# Altium project TMDX654GPEVM.PrjPcb (part 14 of 24)

## Sheet 32-APPLICATION BOARD CONNECTOR.SchDoc
size 513 x 386 mm
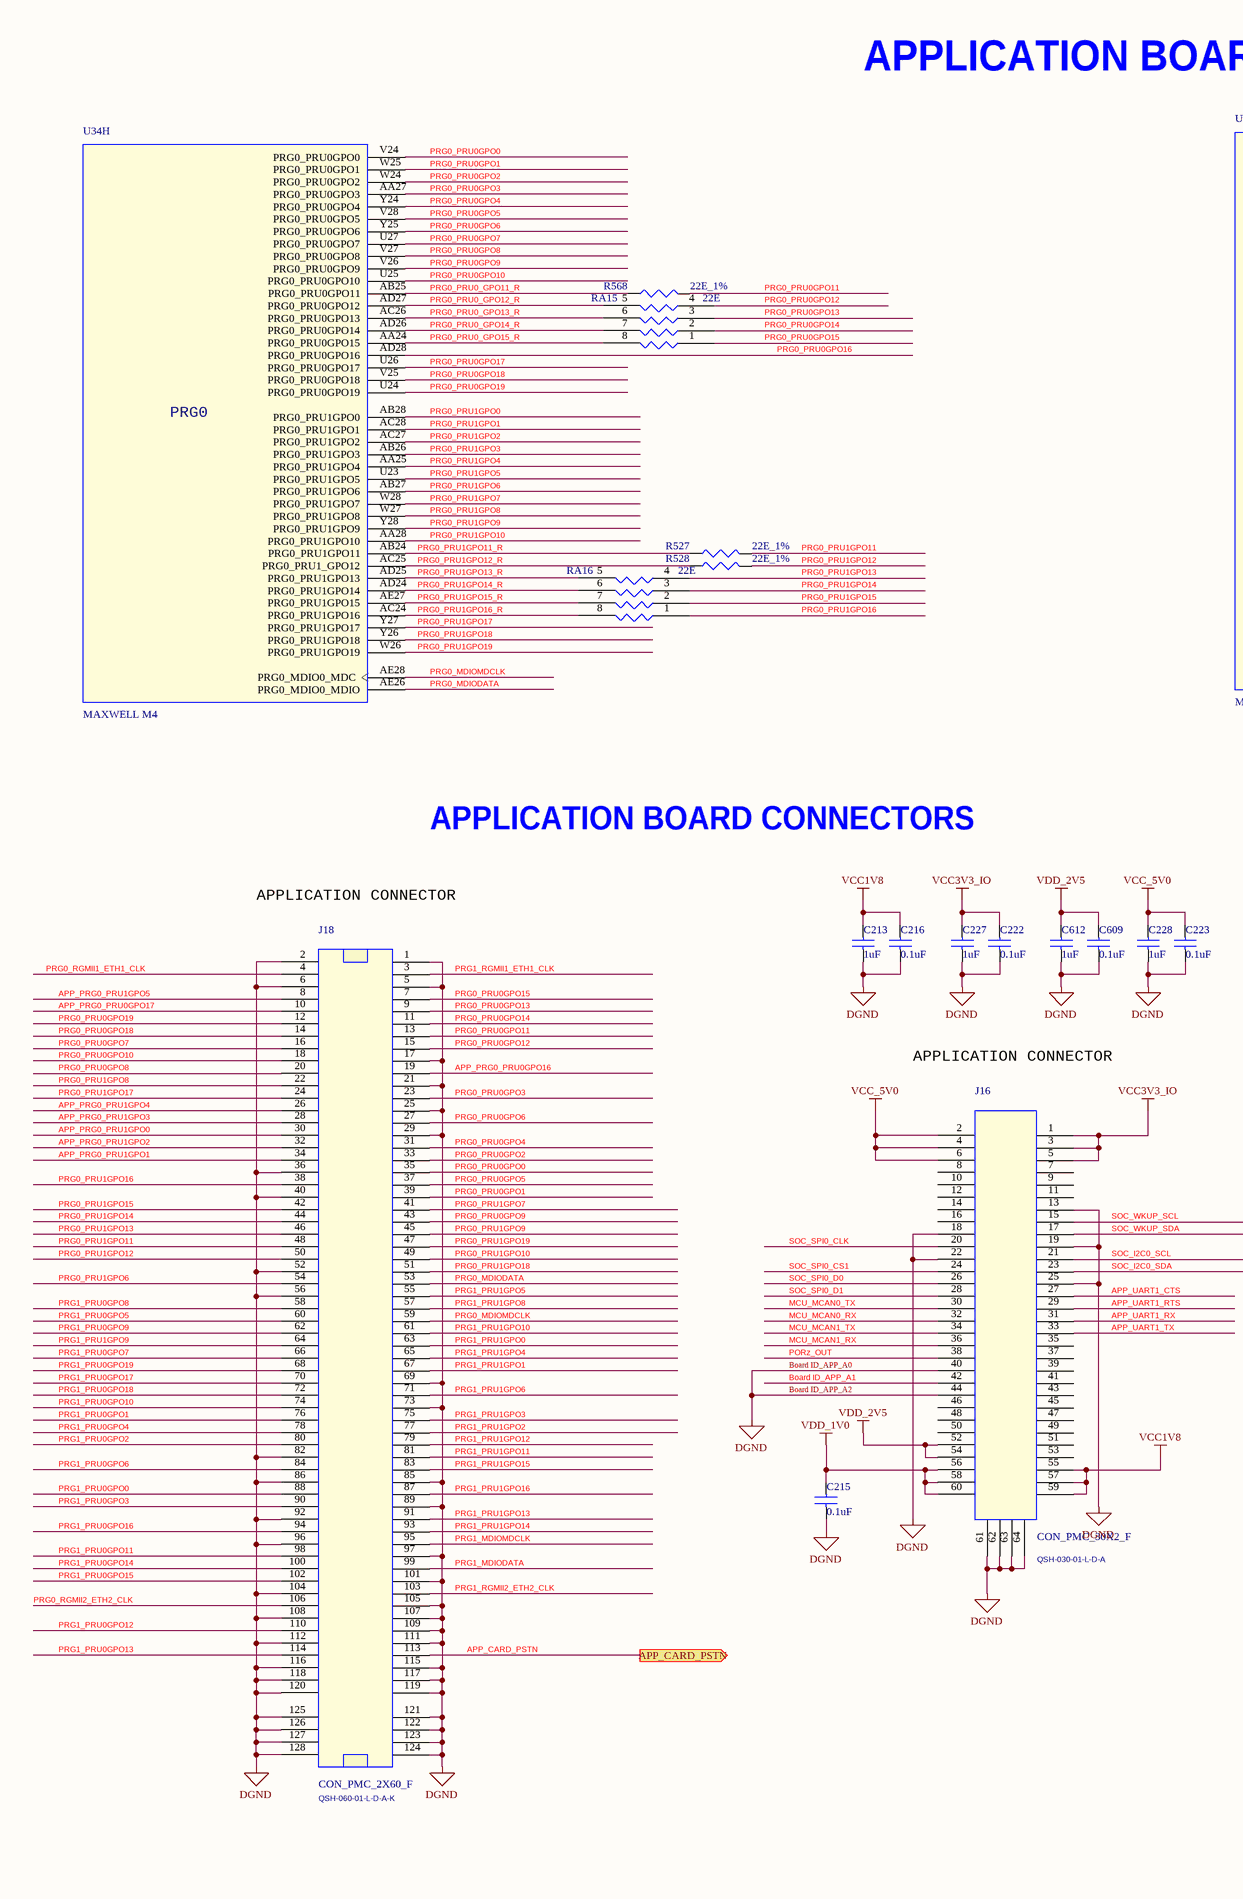
[diagram p58: 32-APPLICATION BOARD CONNECTOR.SchDoc, left]
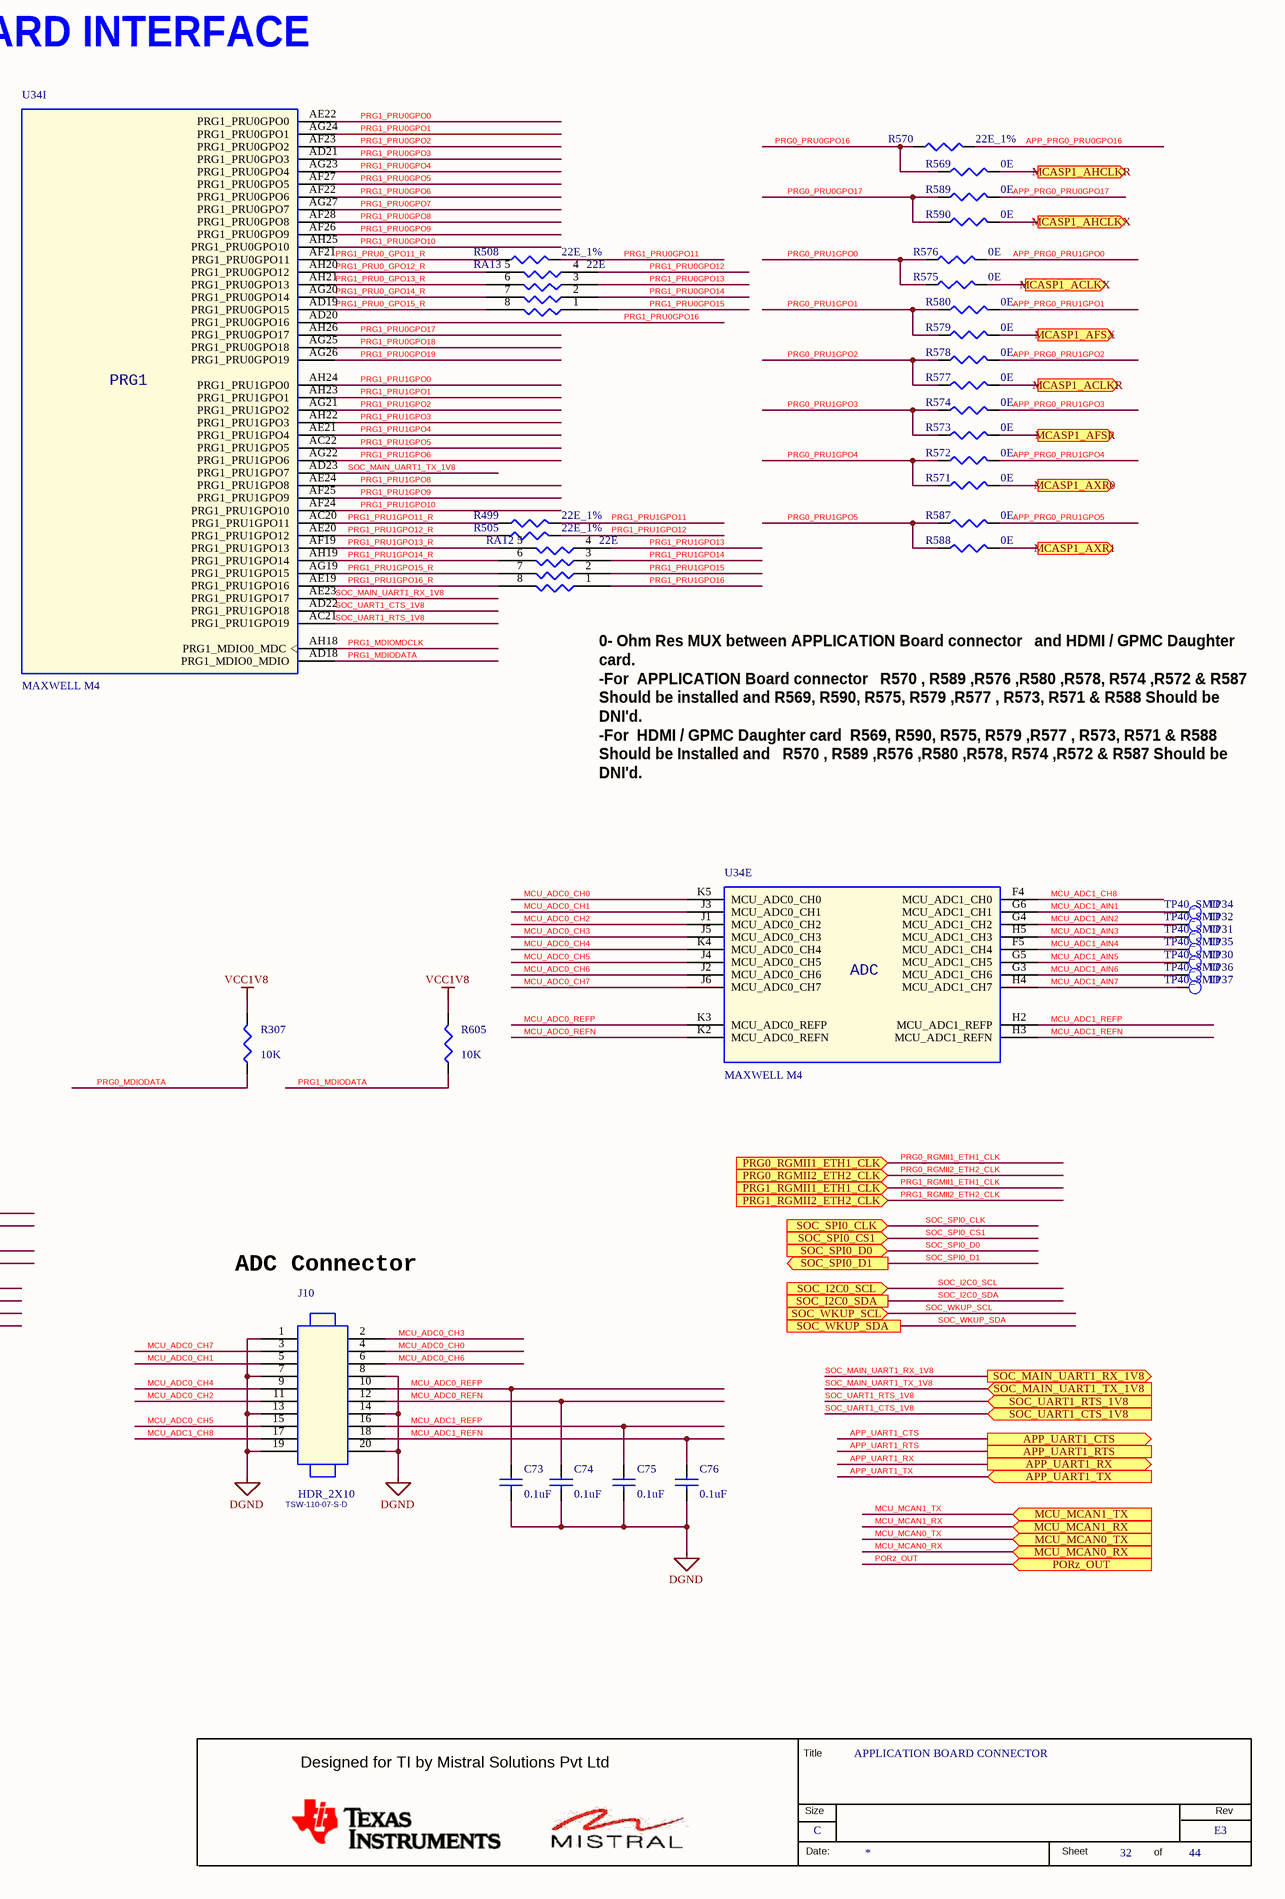
[diagram p59: 32-APPLICATION BOARD CONNECTOR.SchDoc, right]

### Parts
(Parts that share a designator on the sheet are numbered #1, #2 ... from top to bottom, then left to right.)
*#32  RevCode: E3  Title: APPLICATION BOARD CONNECTOR  Page Size: C  Page Number: 32  Page Count: 44  (hidden comment: MISTRAL_TITLEBLK_CSIZE)  (graphical)
C73  0.1uF  [CAP0201_0-5]
C74  0.1uF  [CAP0201_0-5]
C75  0.1uF  [CAP0201_0-5]
C76  0.1uF  [CAP0201_0-5]
C213  1uF  [CAP0402_0-75]
C215  0.1uF  [CAP0201_0-5]
C216  0.1uF  [CAP0201_0-5]
C222  0.1uF  [CAP0201_0-5]
C223  0.1uF  [CAP0201_0-5]
C227  1uF  [CAP0402_0-75]
C228  1uF  [CAP0402_0-75]
C609  0.1uF  [CAP0201_0-5]
C612  1uF  [CAP0402_0-75]
J10  HDR_2X10  Mfr_part_number: TSW-110-07-S-D  [HDR_2X10_TSW_100_S_T]
J16  CON_PMC_30X2_F  Mfr_part_number: QSH-030-01-L-D-A  [CON_PMC30X2_QSH-030-01-L_S_S_S]
J18  CON_PMC_2X60_F  Mfr_part_number: QSH-060-01-L-D-A-K  [CON_PMC60X2_HQCD-060_S_S_S_3-3]
R307  10K  [RES0402_0-5]
R499  22E_1%  [RES0402]
R505  22E_1%  [RES0402]
R508  22E_1%  [RES0402]
R527  22E_1%  [RES0402]
R528  22E_1%  [RES0402]
R568  22E_1%  [RES0402]
R569  0E  [RES0402_0-5]
R570  22E_1%  [RES0402]
R571  0E  [RES0402_0-5]
R572  0E  [RES0402_0-5]
R573  0E  [RES0402_0-5]
R574  0E  [RES0402_0-5]
R575  0E  [RES0402_0-5]
R576  0E  [RES0402_0-5]
R577  0E  [RES0402_0-5]
R578  0E  [RES0402_0-5]
R579  0E  [RES0402_0-5]
R580  0E  [RES0402_0-5]
R587  0E  [RES0402_0-5]
R588  0E  [RES0402_0-5]
R589  0E  [RES0402_0-5]
R590  0E  [RES0402_0-5]
R605  10K  [RES0402_0-5]
RA12  22E  [RESA_EXB28V_0402-4_0-5]
RA13  22E  [RESA_EXB28V_0402-4_0-5]
RA15  22E  [RESA_EXB28V_0402-4_0-5]
RA16  22E  [RESA_EXB28V_0402-4_0-5]
TP30  TP40_SMD  [TP40_SMD]
TP31  TP40_SMD  [TP40_SMD]
TP32  TP40_SMD  [TP40_SMD]
TP34  TP40_SMD  [TP40_SMD]
TP35  TP40_SMD  [TP40_SMD]
TP36  TP40_SMD  [TP40_SMD]
TP37  TP40_SMD  [TP40_SMD]
U34  MAXWELL M4  [BGA784_31-49_910X910_1-7]  (parts E,H,I of 19)

### Ports
APP_CARD_PSTN (out), APP_UART1_CTS (out), APP_UART1_RTS, APP_UART1_RX (out), APP_UART1_TX (in), MCASP1_ACLKR (out), MCASP1_ACLKX (out), MCASP1_AFSR (out), MCASP1_AFSX (out), MCASP1_AHCLKR (out), MCASP1_AHCLKX (out), MCASP1_AXR0 (out), MCASP1_AXR1 (out), MCU_MCAN0_RX (in), MCU_MCAN0_TX (in), MCU_MCAN1_RX (in), MCU_MCAN1_TX (in), PORz_OUT (in), PRG0_RGMII1_ETH1_CLK (in), PRG0_RGMII2_ETH2_CLK (in), PRG1_RGMII1_ETH1_CLK (in), PRG1_RGMII2_ETH2_CLK (in), SOC_I2C0_SCL (in), SOC_I2C0_SDA, SOC_MAIN_UART1_RX_1V8 (out), SOC_MAIN_UART1_TX_1V8 (in), SOC_SPI0_CLK (in), SOC_SPI0_CS1 (in), SOC_SPI0_D0 (in), SOC_SPI0_D1 (out), SOC_UART1_CTS_1V8 (in), SOC_UART1_RTS_1V8 (in), SOC_WKUP_SCL (in), SOC_WKUP_SDA

### Nets
DGND: C73.2 C74.2 C75.2 C76.2 C213.2 C215.2 C216.2 C222.2 C223.2 C227.2 C228.2 C609.2 C612.2 J10.1 J10.7 J10.8 J10.13 J10.14 J10.19 J10.20 J16.13 J16.18 J16.19 J16.22 J16.25 J16.40 J16.44 J16.61 J16.62 J16.63 J16.64 J18.1 J18.2 J18.5 J18.6 J18.17 J18.21 J18.25 J18.29 J18.36 J18.40 J18.52 J18.56 J18.69 J18.73 J18.82 J18.85 J18.86 J18.89 J18.92 J18.96 J18.97 J18.101 J18.104 J18.105 J18.107 J18.108 J18.109 J18.111 J18.112 J18.115 J18.116 J18.117 J18.118 J18.119 J18.120 J18.121 J18.122 J18.123 J18.124 J18.125 J18.126 J18.127 J18.128
VCC1V8: C213.1 C216.1 J16.55 J16.57 J16.59 R307.2 R605.2
VCC3V3_IO: C222.1 C227.1 J16.1 J16.3 J16.5
VCC_5V0: C223.1 C228.1 J16.2 J16.4 J16.6
VDD_1V0: C215.1 J16.56 J16.58 J16.60
VDD_2V5: C609.1 C612.1 J16.52 J16.54
APP_CARD_PSTN: J18.113 ; port APP_CARD_PSTN
APP_PRG0_PRU0GPO16: J18.19 R570.2
APP_PRG0_PRU0GPO17: J18.10 R589.2
APP_PRG0_PRU1GPO0: J18.30 R576.2
APP_PRG0_PRU1GPO1: J18.34 R580.2
APP_PRG0_PRU1GPO2: J18.32 R578.2
APP_PRG0_PRU1GPO3: J18.28 R574.2
APP_PRG0_PRU1GPO4: J18.26 R572.2
APP_PRG0_PRU1GPO5: J18.8 R587.2
APP_UART1_CTS: J16.27 ; port APP_UART1_CTS
APP_UART1_RTS: J16.29 ; port APP_UART1_RTS
APP_UART1_RX: J16.31 ; port APP_UART1_RX
APP_UART1_TX: J16.33 ; port APP_UART1_TX
Board ID_APP_A1: J16.42
MCASP1_ACLKR: R577.2 ; port MCASP1_ACLKR
MCASP1_ACLKX: R575.2 ; port MCASP1_ACLKX
MCASP1_AFSR: R573.2 ; port MCASP1_AFSR
MCASP1_AFSX: R579.2 ; port MCASP1_AFSX
MCASP1_AHCLKR: R569.2 ; port MCASP1_AHCLKR
MCASP1_AHCLKX: R590.2 ; port MCASP1_AHCLKX
MCASP1_AXR0: R571.2 ; port MCASP1_AXR0
MCASP1_AXR1: R588.2 ; port MCASP1_AXR1
MCU_ADC0_CH0: J10.4 U34.K5(MCU_ADC0_CH0)
MCU_ADC0_CH1: J10.5 U34.J3(MCU_ADC0_CH1)
MCU_ADC0_CH2: J10.11 U34.J1(MCU_ADC0_CH2)
MCU_ADC0_CH3: J10.2 U34.J5(MCU_ADC0_CH3)
MCU_ADC0_CH4: J10.9 U34.K4(MCU_ADC0_CH4)
MCU_ADC0_CH5: J10.15 U34.J4(MCU_ADC0_CH5)
MCU_ADC0_CH6: J10.6 U34.J2(MCU_ADC0_CH6)
MCU_ADC0_CH7: J10.3 U34.J6(MCU_ADC0_CH7)
MCU_ADC0_REFN: C74.1 J10.12 U34.K2(MCU_ADC0_REFN)
MCU_ADC0_REFP: C73.1 J10.10 U34.K3(MCU_ADC0_REFP)
MCU_ADC1_AIN1: TP34.1(TP) U34.G6(MCU_ADC1_CH1)
MCU_ADC1_AIN2: TP32.1(TP) U34.G4(MCU_ADC1_CH2)
MCU_ADC1_AIN3: TP31.1(TP) U34.H5(MCU_ADC1_CH3)
MCU_ADC1_AIN4: TP35.1(TP) U34.F5(MCU_ADC1_CH4)
MCU_ADC1_AIN5: TP30.1(TP) U34.G5(MCU_ADC1_CH5)
MCU_ADC1_AIN6: TP36.1(TP) U34.G3(MCU_ADC1_CH6)
MCU_ADC1_AIN7: TP37.1(TP) U34.H4(MCU_ADC1_CH7)
MCU_ADC1_CH8: J10.17 U34.F4(MCU_ADC1_CH0)
MCU_ADC1_REFN: C76.1 J10.18 U34.H3(MCU_ADC1_REFN)
MCU_ADC1_REFP: C75.1 J10.16 U34.H2(MCU_ADC1_REFP)
MCU_MCAN0_RX: J16.32 ; port MCU_MCAN0_RX
MCU_MCAN0_TX: J16.30 ; port MCU_MCAN0_TX
MCU_MCAN1_RX: J16.36 ; port MCU_MCAN1_RX
MCU_MCAN1_TX: J16.34 ; port MCU_MCAN1_TX
PORz_OUT: J16.38 ; port PORz_OUT
PRG0_MDIODATA: J18.53 R307.1 U34.AE26(PRG0_MDIO0_MDIO)
PRG0_MDIOMDCLK: J18.59 U34.AE28(PRG0_MDIO0_MDC)
PRG0_PRU0_GPO11_R: R568.1 U34.AB25(PRG0_PRU0GPO11)
PRG0_PRU0_GPO12_R: RA15.5 U34.AD27(PRG0_PRU0GPO12)
PRG0_PRU0_GPO13_R: RA15.6 U34.AC26(PRG0_PRU0GPO13)
PRG0_PRU0_GPO14_R: RA15.7 U34.AD26(PRG0_PRU0GPO14)
PRG0_PRU0_GPO15_R: RA15.8 U34.AA24(PRG0_PRU0GPO15)
PRG0_PRU0GPO0: J18.35 U34.V24(PRG0_PRU0GPO0)
PRG0_PRU0GPO1: J18.39 U34.W25(PRG0_PRU0GPO1)
PRG0_PRU0GPO2: J18.33 U34.W24(PRG0_PRU0GPO2)
PRG0_PRU0GPO3: J18.23 U34.AA27(PRG0_PRU0GPO3)
PRG0_PRU0GPO4: J18.31 U34.Y24(PRG0_PRU0GPO4)
PRG0_PRU0GPO5: J18.37 U34.V28(PRG0_PRU0GPO5)
PRG0_PRU0GPO6: J18.27 U34.Y25(PRG0_PRU0GPO6)
PRG0_PRU0GPO7: J18.16 U34.U27(PRG0_PRU0GPO7)
PRG0_PRU0GPO8: J18.20 U34.V27(PRG0_PRU0GPO8)
PRG0_PRU0GPO9: J18.43 U34.V26(PRG0_PRU0GPO9)
PRG0_PRU0GPO10: J18.18 U34.U25(PRG0_PRU0GPO10)
PRG0_PRU0GPO11: J18.13 R568.2
PRG0_PRU0GPO12: J18.15 RA15.4
PRG0_PRU0GPO13: J18.9 RA15.3
PRG0_PRU0GPO14: J18.11 RA15.2
PRG0_PRU0GPO15: J18.7 RA15.1
PRG0_PRU0GPO16: R569.1 R570.1 U34.AD28(PRG0_PRU0GPO16)
PRG0_PRU0GPO17: R589.1 R590.1 U34.U26(PRG0_PRU0GPO17)
PRG0_PRU0GPO18: J18.14 U34.V25(PRG0_PRU0GPO18)
PRG0_PRU0GPO19: J18.12 U34.U24(PRG0_PRU0GPO19)
PRG0_PRU1GPO0: R575.1 R576.1 U34.AB28(PRG0_PRU1GPO0)
PRG0_PRU1GPO1: R579.1 R580.1 U34.AC28(PRG0_PRU1GPO1)
PRG0_PRU1GPO2: R577.1 R578.1 U34.AC27(PRG0_PRU1GPO2)
PRG0_PRU1GPO3: R573.1 R574.1 U34.AB26(PRG0_PRU1GPO3)
PRG0_PRU1GPO4: R571.1 R572.1 U34.AA25(PRG0_PRU1GPO4)
PRG0_PRU1GPO5: R587.1 R588.1 U34.U23(PRG0_PRU1GPO5)
PRG0_PRU1GPO6: J18.54 U34.AB27(PRG0_PRU1GPO6)
PRG0_PRU1GPO7: J18.41 U34.W28(PRG0_PRU1GPO7)
PRG0_PRU1GPO8: J18.22 U34.W27(PRG0_PRU1GPO8)
PRG0_PRU1GPO9: J18.45 U34.Y28(PRG0_PRU1GPO9)
PRG0_PRU1GPO10: J18.49 U34.AA28(PRG0_PRU1GPO10)
PRG0_PRU1GPO11: J18.48 R527.2
PRG0_PRU1GPO11_R: R527.1 U34.AB24(PRG0_PRU1GPO11)
PRG0_PRU1GPO12: J18.50 R528.2
PRG0_PRU1GPO12_R: R528.1 U34.AC25(PRG0_PRU1_GPO12)
PRG0_PRU1GPO13: J18.46 RA16.4
PRG0_PRU1GPO13_R: RA16.5 U34.AD25(PRG0_PRU1GPO13)
PRG0_PRU1GPO14: J18.44 RA16.3
PRG0_PRU1GPO14_R: RA16.6 U34.AD24(PRG0_PRU1GPO14)
PRG0_PRU1GPO15: J18.42 RA16.2
PRG0_PRU1GPO15_R: RA16.7 U34.AE27(PRG0_PRU1GPO15)
PRG0_PRU1GPO16: J18.38 RA16.1
PRG0_PRU1GPO16_R: RA16.8 U34.AC24(PRG0_PRU1GPO16)
PRG0_PRU1GPO17: J18.24 U34.Y27(PRG0_PRU1GPO17)
PRG0_PRU1GPO18: J18.51 U34.Y26(PRG0_PRU1GPO18)
PRG0_PRU1GPO19: J18.47 U34.W26(PRG0_PRU1GPO19)
PRG0_RGMII1_ETH1_CLK: J18.4 ; port PRG0_RGMII1_ETH1_CLK
PRG0_RGMII2_ETH2_CLK: J18.106 ; port PRG0_RGMII2_ETH2_CLK
PRG1_MDIODATA: J18.99 R605.1 U34.AD18(PRG1_MDIO0_MDIO)
PRG1_MDIOMDCLK: J18.95 U34.AH18(PRG1_MDIO0_MDC)
PRG1_PRU0_GPO11_R: R508.1 U34.AF21(PRG1_PRU0GPO11)
PRG1_PRU0_GPO12_R: RA13.5 U34.AH20(PRG1_PRU0GPO12)
PRG1_PRU0_GPO13_R: RA13.6 U34.AH21(PRG1_PRU0GPO13)
PRG1_PRU0_GPO14_R: RA13.7 U34.AG20(PRG1_PRU0GPO14)
PRG1_PRU0_GPO15_R: RA13.8 U34.AD19(PRG1_PRU0GPO15)
PRG1_PRU0GPO0: J18.88 U34.AE22(PRG1_PRU0GPO0)
PRG1_PRU0GPO1: J18.76 U34.AG24(PRG1_PRU0GPO1)
PRG1_PRU0GPO2: J18.80 U34.AF23(PRG1_PRU0GPO2)
PRG1_PRU0GPO3: J18.90 U34.AD21(PRG1_PRU0GPO3)
PRG1_PRU0GPO4: J18.78 U34.AG23(PRG1_PRU0GPO4)
PRG1_PRU0GPO5: J18.60 U34.AF27(PRG1_PRU0GPO5)
PRG1_PRU0GPO6: J18.84 U34.AF22(PRG1_PRU0GPO6)
PRG1_PRU0GPO7: J18.66 U34.AG27(PRG1_PRU0GPO7)
PRG1_PRU0GPO8: J18.58 U34.AF28(PRG1_PRU0GPO8)
PRG1_PRU0GPO9: J18.62 U34.AF26(PRG1_PRU0GPO9)
PRG1_PRU0GPO10: J18.74 U34.AH25(PRG1_PRU0GPO10)
PRG1_PRU0GPO11: J18.98 R508.2
PRG1_PRU0GPO12: J18.110 RA13.4
PRG1_PRU0GPO13: J18.114 RA13.3
PRG1_PRU0GPO14: J18.100 RA13.2
PRG1_PRU0GPO15: J18.102 RA13.1
PRG1_PRU0GPO16: J18.94 U34.AD20(PRG1_PRU0GPO16)
PRG1_PRU0GPO17: J18.70 U34.AH26(PRG1_PRU0GPO17)
PRG1_PRU0GPO18: J18.72 U34.AG25(PRG1_PRU0GPO18)
PRG1_PRU0GPO19: J18.68 U34.AG26(PRG1_PRU0GPO19)
PRG1_PRU1GPO0: J18.63 U34.AH24(PRG1_PRU1GPO0)
PRG1_PRU1GPO1: J18.67 U34.AH23(PRG1_PRU1GPO1)
PRG1_PRU1GPO2: J18.77 U34.AG21(PRG1_PRU1GPO2)
PRG1_PRU1GPO3: J18.75 U34.AH22(PRG1_PRU1GPO3)
PRG1_PRU1GPO4: J18.65 U34.AE21(PRG1_PRU1GPO4)
PRG1_PRU1GPO5: J18.55 U34.AC22(PRG1_PRU1GPO5)
PRG1_PRU1GPO6: J18.71 U34.AG22(PRG1_PRU1GPO6)
PRG1_PRU1GPO8: J18.57 U34.AE24(PRG1_PRU1GPO8)
PRG1_PRU1GPO9: J18.64 U34.AF25(PRG1_PRU1GPO9)
PRG1_PRU1GPO10: J18.61 U34.AF24(PRG1_PRU1GPO10)
PRG1_PRU1GPO11: J18.81 R499.2
PRG1_PRU1GPO11_R: R499.1 U34.AC20(PRG1_PRU1GPO11)
PRG1_PRU1GPO12: J18.79 R505.2
PRG1_PRU1GPO12_R: R505.1 U34.AE20(PRG1_PRU1GPO12)
PRG1_PRU1GPO13: J18.91 RA12.4
PRG1_PRU1GPO13_R: RA12.5 U34.AF19(PRG1_PRU1GPO13)
PRG1_PRU1GPO14: J18.93 RA12.3
PRG1_PRU1GPO14_R: RA12.6 U34.AH19(PRG1_PRU1GPO14)
PRG1_PRU1GPO15: J18.83 RA12.2
PRG1_PRU1GPO15_R: RA12.7 U34.AG19(PRG1_PRU1GPO15)
PRG1_PRU1GPO16: J18.87 RA12.1
PRG1_PRU1GPO16_R: RA12.8 U34.AE19(PRG1_PRU1GPO16)
PRG1_RGMII1_ETH1_CLK: J18.3 ; port PRG1_RGMII1_ETH1_CLK
PRG1_RGMII2_ETH2_CLK: J18.103 ; port PRG1_RGMII2_ETH2_CLK
SOC_I2C0_SCL: J16.21 ; port SOC_I2C0_SCL
SOC_I2C0_SDA: J16.23 ; port SOC_I2C0_SDA
SOC_MAIN_UART1_RX_1V8: U34.AE23(PRG1_PRU1GPO17) ; port SOC_MAIN_UART1_RX_1V8
SOC_MAIN_UART1_TX_1V8: U34.AD23(PRG1_PRU1GPO7) ; port SOC_MAIN_UART1_TX_1V8
SOC_SPI0_CLK: J16.20 ; port SOC_SPI0_CLK
SOC_SPI0_CS1: J16.24 ; port SOC_SPI0_CS1
SOC_SPI0_D0: J16.26 ; port SOC_SPI0_D0
SOC_SPI0_D1: J16.28 ; port SOC_SPI0_D1
SOC_UART1_CTS_1V8: U34.AD22(PRG1_PRU1GPO18) ; port SOC_UART1_CTS_1V8
SOC_UART1_RTS_1V8: U34.AC21(PRG1_PRU1GPO19) ; port SOC_UART1_RTS_1V8
SOC_WKUP_SCL: J16.15 ; port SOC_WKUP_SCL
SOC_WKUP_SDA: J16.17 ; port SOC_WKUP_SDA

Not connected (* = marked no-connect by the designer): J16 7 8 9 10 11 12 14 16 35 37 39 41 43 45 46 47 48 49 50 51 53

### Notes on the sheet
- APPLICATION BOARD INTERFACE
- (near RA12) 0- Ohm Res MUX between APPLICATION Board connector   and HDMI / GPMC Daughter
  card.
  -For  APPLICATION Board connector   R570 , R589 ,R576 ,R580 ,R578, R574 ,R572 & R587
  Should be installed and R569, R590, R575, R579 ,R577 , R573, R571 & R588 Should be
  DNI'd.
  -For  HDMI / GPMC Daughter card  R569, R590, R575, R579 ,R577 , R573, R571 & R588
  Should be Installed and   R570 , R589 ,R576 ,R580 ,R578, R574 ,R572 & R587 Should be
  DNI'd.
- APPLICATION BOARD CONNECTORS
- APPLICATION CONNECTOR
- ADC Connector
- Board ID_APP_A0
- Board ID_APP_A2
- (in symbol AM654X_BGA784, part E) ADC
- (in symbol AM654X_BGA784, part H) PRG0
- (in symbol AM654X_BGA784, part I) PRG1
- (in symbol MISTRAL_TITLEBLK_CSIZE) Title; Designed for TI by Mistral Solutions Pvt Ltd; Size; Rev; Date:; Sheet; of

### Library data of the parts
*#32 = MISTRAL_TITLEBLK_CSIZE: Issue: 1.0; Page Create Date: March  8, 1995; Page Modify Date: *
C73 C75 C216 C223 = CAP_Dup5: CAP CERAMIC 0.1uF 16V 10% X5R 0201; Part_type: CAPACITORS\CERAMIC; Mfr_part_number: GRM033R61C104KE84J; Mfr_name: MURATA; Mistral Part No: 120009030072-R; Custom_Duty: 15%; Customs_HS_Code: 85322990; Wattage: NA; Project: TI_MAXIE_CPB; Library Ref: CAP; MECHANICAL 3D STEP FILE: CAP0201_0-5; Chkd/date: MANIRAJA/120218; Crtd /date: MANIRAJA/120218; Datasheet: Y:\MIS_DATABASE\DATASHEETS\CAPACITORS\GRM033R61C104KE84.PDF; Temperature: -55°C+85°C; Weight: 0.33mg; Height: 0.33MM; Distributor_part_number: 490-16742-1-ND; Distributor_name: DIGIKEY; Package: 0201; Voltage: 16V; Tolerance: 10%; PCB Footprint: CAP0201_0-5
C74 C76 C215 C222 C609 = CAP_Dup5: CAP CERAMIC 0.1uF 16V 10% X5R 0201; Mistral Part No: 120009030072-R; Mfr_name: MURATA; Mfr_part_number: GRM033R61C104KE84J; Part_type: CAPACITORS\CERAMIC; Project: TI_MAXIE_CPB; Wattage: NA; Customs_HS_Code: 85322990; Custom_Duty: 15%; Library Ref: CAP; Tolerance: 10%; Voltage: 16V; Package: 0201; Distributor_name: DIGIKEY; Distributor_part_number: 490-16742-1-ND; Height: 0.33MM; Weight: 0.33mg; Temperature: -55°C+85°C; Datasheet: Y:\MIS_DATABASE\DATASHEETS\CAPACITORS\GRM033R61C104KE84.PDF; Crtd /date: MANIRAJA/120218; Chkd/date: MANIRAJA/120218; MECHANICAL 3D STEP FILE: CAP0201_0-5; PCB Footprint: CAP0201_0-5
C213 C228 C612 = CAP_Dup5: CAP CERAMIC 1uF 16V 20% X5R 0402; Mistral Part No: 120018020006-R; Mfr_name: TAIYO YUDEN; Mfr_part_number: EMK105BJ105MV-F; Part_type: CAPACITORS\CERAMIC; Wattage: NA; Project: TI_MAXIE_CPB; Customs_HS_Code: 85322990; Custom_Duty: 15%; Footprint Ref: CAP0402_0-75; Library Ref: CAP; Footprint Path: Y:\MIS_DATABASE\Library\ALTIUM_TOOL\PCB_FOOTPRINTS\Altium_Footprint_Lib.PcbLib; Library Path: Y:\MIS_DATABASE\Library\ALTIUM_TOOL\SCHEMATICS_PARTS\MS_DISCRETE_Library.schlib; MECHANICAL 3D STEP FILE: CAP0402_0-75; PCB Footprint: CAP0402_0-75; Tolerance: 20%; Voltage: 16V; Package: 0402; Distributor_name: DIGIKEY; Distributor_part_number: 587-5514-1-ND; Height: 0.55MM; Weight: 0.65mg; Temperature: -55°C+85°C; Datasheet: Y:\MIS_DATABASE\DATASHEETS\CAPACITORS\EMK105BJ105MV-F.PDF; Crtd /date: ALVY/150218; Chkd/date: MANIRAJA/150218
C227 = CAP_Dup5: CAP CERAMIC 1uF 16V 20% X5R 0402; Part_type: CAPACITORS\CERAMIC; Mfr_part_number: EMK105BJ105MV-F; Mfr_name: TAIYO YUDEN; Mistral Part No: 120018020006-R; Wattage: NA; Custom_Duty: 15%; Customs_HS_Code: 85322990; Project: TI_MAXIE_CPB; Footprint Ref: CAP0402_0-75; Library Ref: CAP; Footprint Path: Y:\MIS_DATABASE\Library\ALTIUM_TOOL\PCB_FOOTPRINTS\Altium_Footprint_Lib.PcbLib; Library Path: Y:\MIS_DATABASE\Library\ALTIUM_TOOL\SCHEMATICS_PARTS\MS_DISCRETE_Library.schlib; MECHANICAL 3D STEP FILE: CAP0402_0-75; PCB Footprint: CAP0402_0-75; Chkd/date: MANIRAJA/150218; Crtd /date: ALVY/150218; Datasheet: Y:\MIS_DATABASE\DATASHEETS\CAPACITORS\EMK105BJ105MV-F.PDF; Temperature: -55°C+85°C; Weight: 0.65mg; Height: 0.55MM; Distributor_part_number: 587-5514-1-ND; Distributor_name: DIGIKEY; Package: 0402; Voltage: 16V; Tolerance: 20%
J10 = HEADER_10X2: CON HDR 2X10 2.54MM PITCH ST TH; Part_type: CONNECTOR\HEADERS; Mfr_name: SAMTEC; Mistral Part No: 150009090001-R; Custom_Duty: 0.24; Customs_HS_Code: 85369090; Wattage: NA; Project: SMART VIEW_NVR; Library Ref: HEADER_10X2; PCB Footprint: HDR_2X10_TSW_100_S_T; Chkd/date: NAVEED/140515; Crtd /date: MAZHAR/020909; Datasheet: Y:\MIS_DATABASE\DATASHEETS\CONNECTORS\TSW-106-23-T-S.PDF; Temperature: NA; Weight: NA; Height: 5.02MM; Distributor_part_number: SAM1032-10-ND; Distributor_name: DIGIKEY; Package: THRU-HOLE; Voltage: NA; Tolerance: NA
J16 = CON_PMC_30X2_F_Dup1: CON PMC 30X2 0.50MM PITCH FEMALE ST SMD; Mistral Part No: 150009030606; Mfr_name: SAMTEC; Part_type: CONNECTOR\PMC; Project: KHAN_HSST; Customs_HS_Code: 85369090; Custom_Duty: 24%; Library Ref: CON_PMC_30X2_F; PCB Footprint: CON_PMC30X2_QSH-030-01-L_S_S_S; Package: SMD; Height: 3.25MM; Datasheet: Y:\MIS_DATABASE\DATASHEETS\CONNECTORS\QSH.PDF; Crtd /date: USMAN/051108; Chkd/date: MAZHAR/180208
J18 = CON_PMC_60X2_HQCD: CON PMC 2X60 0.50MM PITCH FEMALE ST SMD; Mistral Part No: 150010060004-R; Mfr_name: SAMTEC; Part_type: CONNECTOR\PMC; Project: CENTAURUS; Tolerance: NA; Customs_HS_Code: 85369090; Custom_Duty: 24%; Library Ref: CON_PMC_60X2_HQCD; PCB Footprint: CON_PMC60X2_HQCD-060_S_S_S_3-3; Voltage: NA; Wattage: NA; Package: SMD; Distributor_name: DIGIKEY; Distributor_part_number: SAM10652-ND; Height: 3.25MM; Weight: NA; Temperature: -55°C+125°C; Datasheet: Y:\MIS_DATABASE\DATASHEETS\CONNECTORS\QSH.PDF; Crtd /date: MUDDU/020610; Chkd/date: MANIRAJA/230817; MECHANICAL 3D STEP FILE: CON_PMC60X2_HQCD-060_S_S_S_3-3
R307 R605 = RESISTOR_Dup5: RES 10K 1/16W 5% 0402; Mistral Part No: 110009030208-R; Mfr_name: YAGEO AMERICA; Mfr_part_number: RC0402JR-0710KL; Part_type: RESISTORS\FIXED; Project: HSE; Voltage: NA; Customs_HS_Code: 85332119; Custom_Duty: 15%; Footprint Path: Y:\MIS_DATABASE\Library\ALTIUM_TOOL\PCB_FOOTPRINTS\Altium_Footprint_Lib.PcbLib; Library Path: Y:\MIS_DATABASE\Library\ALTIUM_TOOL\SCHEMATICS_PARTS\MS_DISCRETE_Library.schlib; Footprint Ref: RES0402_0-5; Library Ref: RESISTOR; Tolerance: 5%; Wattage: 1/16W; Package: 0402; Distributor_name: DIGIKEY; Distributor_part_number: 311-10KJRCT-ND; Height: 0.40MM; Weight: 0.65mg; Temperature: -55°C+155°C; Datasheet: Y:\MIS_DATABASE\DATASHEETS\RESISTORS\YAGEO-RC0402.PDF; Crtd /date: MAZHAR/230805; Chkd/date: VASANTHA/061216; RoHS: Pb-Free; MECHANICAL 3D STEP FILE: RES0402_0-5; PCB Footprint: RES0402_0-5
R499 R508 R527 R528 R568 R570 = RESISTOR_Dup5: RES 22E 1/16W 1% 0402; Mistral Part No: 110009090004-P; Mfr_name: YAGEO AMERICA; Mfr_part_number: RC0402FR-0722RL; Part_type: RESISTORS\FIXED; Alternate_mfr_name_A: VISHAY; Alternate_mfr_part_number_A: CRCW040222R0FKED; Cust_part_number: 4700-80047E; Project: VMEFMCD; Voltage: 50V; Customs_HS_Code: 85332119; Custom_Duty: 15%; Remarks: In alternate datasheet it is RoHS COMPLIANT. Y:\MIS_DATABASE\DATASHEETS\RESISTORS\CRCW0402.PDF; Library Ref: RESISTOR; PCB Footprint: RES0402; Tolerance: 1%; Wattage: 1/16W; Package: 0402; Distributor_name: DIGIKEY; Distributor_part_number: 311-22.0LRCT-ND; Distributor_name_A: DIGIKEY; Distributor_part_number_A: 541-22.0LCT-ND; Height: 0.40MM; Weight: 0.8g/1000pcs; Temperature: -55°C+155°C; Datasheet: Y:\MIS_DATABASE\DATASHEETS\RESISTORS\YAGEO-RC0402.PDF; Crtd /date: MAZHAR/090909; Chkd/date: SUHAS/290910; RoHS: Pb-Free
R505 = RESISTOR_Dup5: RES 22E 1/16W 1% 0402; Cust_part_number: 4700-80047E; Alternate_mfr_part_number_A: CRCW040222R0FKED; Alternate_mfr_name_A: VISHAY; Part_type: RESISTORS\FIXED; Mfr_part_number: RC0402FR-0722RL; Mfr_name: YAGEO AMERICA; Mistral Part No: 110009090004-P; Remarks: In alternate datasheet it is RoHS COMPLIANT. Y:\MIS_DATABASE\DATASHEETS\RESISTORS\CRCW0402.PDF; Custom_Duty: 15%; Customs_HS_Code: 85332119; Voltage: 50V; Project: VMEFMCD; Library Ref: RESISTOR; PCB Footprint: RES0402; RoHS: Pb-Free; Chkd/date: SUHAS/290910; Crtd /date: MAZHAR/090909; Datasheet: Y:\MIS_DATABASE\DATASHEETS\RESISTORS\YAGEO-RC0402.PDF; Temperature: -55°C+155°C; Weight: 0.8g/1000pcs; Height: 0.40MM; Distributor_part_number_A: 541-22.0LCT-ND; Distributor_name_A: DIGIKEY; Distributor_part_number: 311-22.0LRCT-ND; Distributor_name: DIGIKEY; Package: 0402; Wattage: 1/16W; Tolerance: 1%
R569 R571 R577 R590 = RESISTOR_Dup5: RES 0E 1/16W 0402; Mistral Part No: 110010080019-P; Mfr_name: VISHAY; Mfr_part_number: CRCW04020000Z0ED; Part_type: RESISTORS\FIXED; Project: PB_BUGBASE; Tolerance: NA; Customs_HS_Code: 85332119; Custom_Duty: 15%; NI_MARK: DNI; Footprint Path: Y:\MIS_DATABASE\Library\ALTIUM_TOOL\PCB_FOOTPRINTS\Altium_Footprint_Lib.PcbLib; Library Path: Y:\MIS_DATABASE\Library\ALTIUM_TOOL\SCHEMATICS_PARTS\MS_DISCRETE_Library.schlib; Footprint Ref: RES0402_0-5; Library Ref: RESISTOR; PCB Footprint: RES0402_0-5; Voltage: NA; Wattage: 1/16W; Package: 0402; Distributor_name: DIGIKEY; Distributor_part_number: 541-0.0JCT-ND; Height: 0.40MM; Weight: 0.65g/1000pcs; Temperature: -55°C+155°C; Datasheet: Y:\MIS_DATABASE\DATASHEETS\RESISTORS\CRCW0603.PDF; Crtd /date: MUDDU/190810; Chkd/date: VASANTHA/201216; RoHS: Pb-Free; MECHANICAL 3D STEP FILE: RES0402_0-5
R572 R578 R589 = RESISTOR_Dup5: RES 0E 1/16W 0402; Mistral Part No: 110010080019-P; Mfr_name: VISHAY; Mfr_part_number: CRCW04020000Z0ED; Part_type: RESISTORS\FIXED; Project: PB_BUGBASE; Tolerance: NA; Customs_HS_Code: 85332119; Custom_Duty: 15%; Footprint Path: Y:\MIS_DATABASE\Library\ALTIUM_TOOL\PCB_FOOTPRINTS\Altium_Footprint_Lib.PcbLib; Library Path: Y:\MIS_DATABASE\Library\ALTIUM_TOOL\SCHEMATICS_PARTS\MS_DISCRETE_Library.schlib; Footprint Ref: RES0402_0-5; Library Ref: RESISTOR; PCB Footprint: RES0402_0-5; Voltage: NA; Wattage: 1/16W; Package: 0402; Distributor_name: DIGIKEY; Distributor_part_number: 541-0.0JCT-ND; Height: 0.40MM; Weight: 0.65g/1000pcs; Temperature: -55°C+155°C; Datasheet: Y:\MIS_DATABASE\DATASHEETS\RESISTORS\CRCW0603.PDF; Crtd /date: MUDDU/190810; Chkd/date: VASANTHA/201216; RoHS: Pb-Free; MECHANICAL 3D STEP FILE: RES0402_0-5
R573 R575 R579 R588 = RESISTOR_Dup5: RES 0E 1/16W 0402; Part_type: RESISTORS\FIXED; Mfr_part_number: CRCW04020000Z0ED; Mfr_name: VISHAY; Mistral Part No: 110010080019-P; Custom_Duty: 15%; Customs_HS_Code: 85332119; Voltage: NA; Project: PB_BUGBASE; NI_MARK: DNI; Footprint Path: Y:\MIS_DATABASE\Library\ALTIUM_TOOL\PCB_FOOTPRINTS\Altium_Footprint_Lib.PcbLib; Library Path: Y:\MIS_DATABASE\Library\ALTIUM_TOOL\SCHEMATICS_PARTS\MS_DISCRETE_Library.schlib; Footprint Ref: RES0402_0-5; Library Ref: RESISTOR; PCB Footprint: RES0402_0-5; MECHANICAL 3D STEP FILE: RES0402_0-5; RoHS: Pb-Free; Chkd/date: VASANTHA/201216; Crtd /date: MUDDU/190810; Datasheet: Y:\MIS_DATABASE\DATASHEETS\RESISTORS\CRCW0603.PDF; Temperature: -55°C+155°C; Weight: 0.65g/1000pcs; Height: 0.40MM; Distributor_part_number: 541-0.0JCT-ND; Distributor_name: DIGIKEY; Package: 0402; Wattage: 1/16W; Tolerance: NA
R574 R576 R580 R587 = RESISTOR_Dup5: RES 0E 1/16W 0402; Part_type: RESISTORS\FIXED; Mfr_part_number: CRCW04020000Z0ED; Mfr_name: VISHAY; Mistral Part No: 110010080019-P; Custom_Duty: 15%; Customs_HS_Code: 85332119; Voltage: NA; Project: PB_BUGBASE; Footprint Path: Y:\MIS_DATABASE\Library\ALTIUM_TOOL\PCB_FOOTPRINTS\Altium_Footprint_Lib.PcbLib; Library Path: Y:\MIS_DATABASE\Library\ALTIUM_TOOL\SCHEMATICS_PARTS\MS_DISCRETE_Library.schlib; Footprint Ref: RES0402_0-5; Library Ref: RESISTOR; PCB Footprint: RES0402_0-5; MECHANICAL 3D STEP FILE: RES0402_0-5; RoHS: Pb-Free; Chkd/date: VASANTHA/201216; Crtd /date: MUDDU/190810; Datasheet: Y:\MIS_DATABASE\DATASHEETS\RESISTORS\CRCW0603.PDF; Temperature: -55°C+155°C; Weight: 0.65g/1000pcs; Height: 0.40MM; Distributor_part_number: 541-0.0JCT-ND; Distributor_name: DIGIKEY; Package: 0402; Wattage: 1/16W; Tolerance: NA
RA12 RA15 RA16 = RESARR_ISO4: RES ARRAY 22E 31mW 5% 0402; Mistral Part No: 110009030021-R; Mfr_name: PANASONIC-ECG; Mfr_part_number: EXB-28V220JX; Part_type: RESISTORS\ARRAY; Project: KHAN_MAIN; Voltage: NA; Library Ref: RESARR_ISO4; Tolerance: 5%; Wattage: 31mW; Package: 0402; Distributor_name: DIGIKEY; Distributor_part_number: Y7220CT-ND; Height: 0.45MM; Weight: 2mg; Temperature: -55°C+125°C; Datasheet: Y:\MIS_DATABASE\DATASHEETS\RESISTORS\EXB-2HV.PDF; Crtd /date: USMAN/261108; Chkd/date: MAZHAR/291208; MECHANICAL 3D STEP FILE: RESA_EXB28V_0402-4_0-5; PCB Footprint: RESA_EXB28V_0402-4_0-5
RA13 = RESARR_ISO4: RES ARRAY 22E 31mW 5% 0402; Part_type: RESISTORS\ARRAY; Mfr_part_number: EXB-28V220JX; Mfr_name: PANASONIC-ECG; Mistral Part No: 110009030021-R; Voltage: NA; Project: KHAN_MAIN; Library Ref: RESARR_ISO4; MECHANICAL 3D STEP FILE: RESA_EXB28V_0402-4_0-5; Chkd/date: MAZHAR/291208; Crtd /date: USMAN/261108; Datasheet: Y:\MIS_DATABASE\DATASHEETS\RESISTORS\EXB-2HV.PDF; Temperature: -55°C+125°C; Weight: 2mg; Height: 0.45MM; Distributor_part_number: Y7220CT-ND; Distributor_name: DIGIKEY; Package: 0402; Wattage: 31mW; Tolerance: 5%; PCB Footprint: RESA_EXB28V_0402-4_0-5
TP30 TP31 TP34 TP36 = TESTPOINT: TESTPOINT CIR 40 SMD; Mistral Part No: 130009030933; Mfr_name: LOCAL; MECHANICAL 3D STEP FILE: NA; Project: RAINIER-3; NI_MARK: DNI; RoHS: NA; Footprint Ref: TP40_SMD; Library Ref: TESTPOINT; Footprint Path: Y:\MIS_DATABASE\Library\ALTIUM_TOOL\PCB_FOOTPRINTS\Altium_Footprint_Lib.PcbLib; Library Path: Y:\MIS_DATABASE\Library\ALTIUM_TOOL\SCHEMATICS_PARTS\MS_DISCRETE_Library.schlib; Datasheet: NA; Temperature: NA; Weight: NA; Wattage: NA; Voltage: NA; Tolerance: NA; Mfr_part_number: TP40_SMD; Part_type: TESTPOINT; Package: SMD; Distributor_name: NA; Distributor_part_number: NA; Height: NA; Crtd /date: MAZHAR/190505; Chkd/date: MAZHAR/190505; PCB Footprint: TP40_SMD
TP32 TP35 TP37 = TESTPOINT: TESTPOINT CIR 40 SMD; Mfr_name: LOCAL; Mistral Part No: 130009030933; Project: RAINIER-3; Tolerance: NA; NI_MARK: DNI; RoHS: NA; Footprint Ref: TP40_SMD; Library Ref: TESTPOINT; Chkd/date: MAZHAR/190505; Crtd /date: MAZHAR/190505; Height: NA; Distributor_part_number: NA; Distributor_name: NA; Package: SMD; Part_type: TESTPOINT; Mfr_part_number: TP40_SMD; Voltage: NA; Wattage: NA; Weight: NA; Temperature: NA; Datasheet: NA; MECHANICAL 3D STEP FILE: NA; Library Path: Y:\MIS_DATABASE\Library\ALTIUM_TOOL\SCHEMATICS_PARTS\MS_DISCRETE_Library.schlib; Footprint Path: Y:\MIS_DATABASE\Library\ALTIUM_TOOL\PCB_FOOTPRINTS\Altium_Footprint_Lib.PcbLib; PCB Footprint: TP40_SMD
U34 = AM654X_BGA784: IC MAXWELL MICRO CONTROLLER UNIT BGA784; Mistral Part No: 141217100003; Mfr_name: TEXAS INSTRUMENTS; Mfr_part_number: MAXWELL M4_EVM; Part_type: ICS\DIGITAL\MICROCONTROLLER; Project: TI_MAXIE_CPB; Tolerance: NA; Customs_HS_Code: 85423100; Custom_Duty: 15%; Library Ref: AM654X_BGA784; Voltage: NA; Wattage: NA; Package: BGA784; Distributor_name: NA; Distributor_part_number: NA; Height: 1.63MM; Weight: NA; Temperature: NA; Datasheet: Y:\MIS_DATABASE\DATASHEETS\ICS\DIGITAL\MICROCONTROLLER\MAXWELLM4.PDF; Crtd /date: MANIRAJA/130717; Chkd/date: MANIRAJA/130717; MECHANICAL 3D STEP FILE: BGA784_31-49_910X910_1-7; PCB Footprint: BGA784_31-49_910X910_1-7

## Sheet 33-SOC_GENERAL AND MCU GENERAL.SchDoc
size 513 x 386 mm
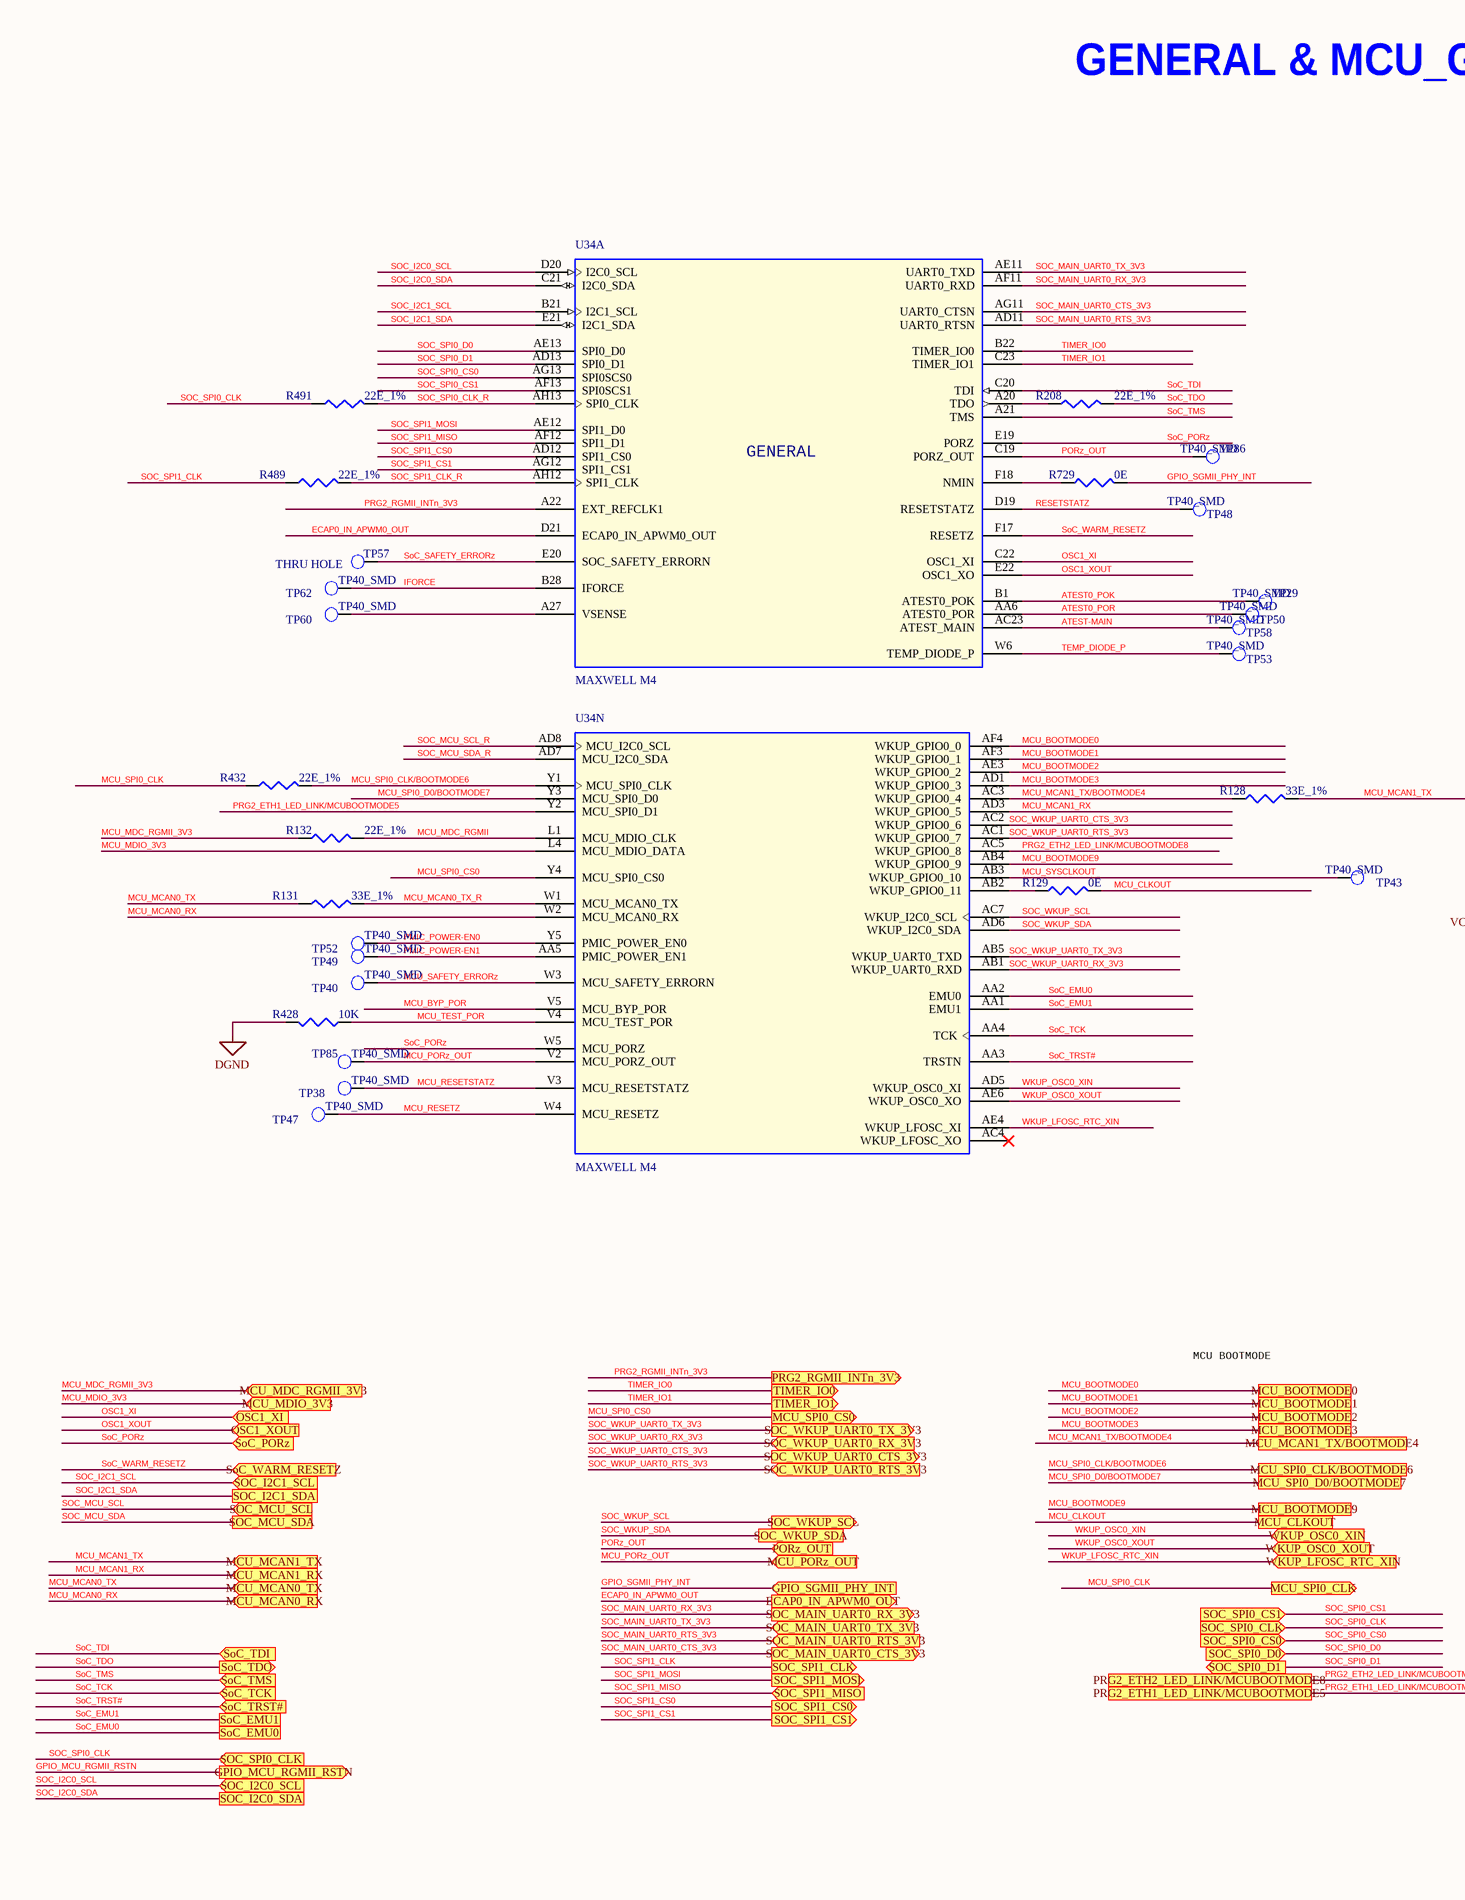
[diagram p60: 33-SOC_GENERAL AND MCU GENERAL.SchDoc, left]
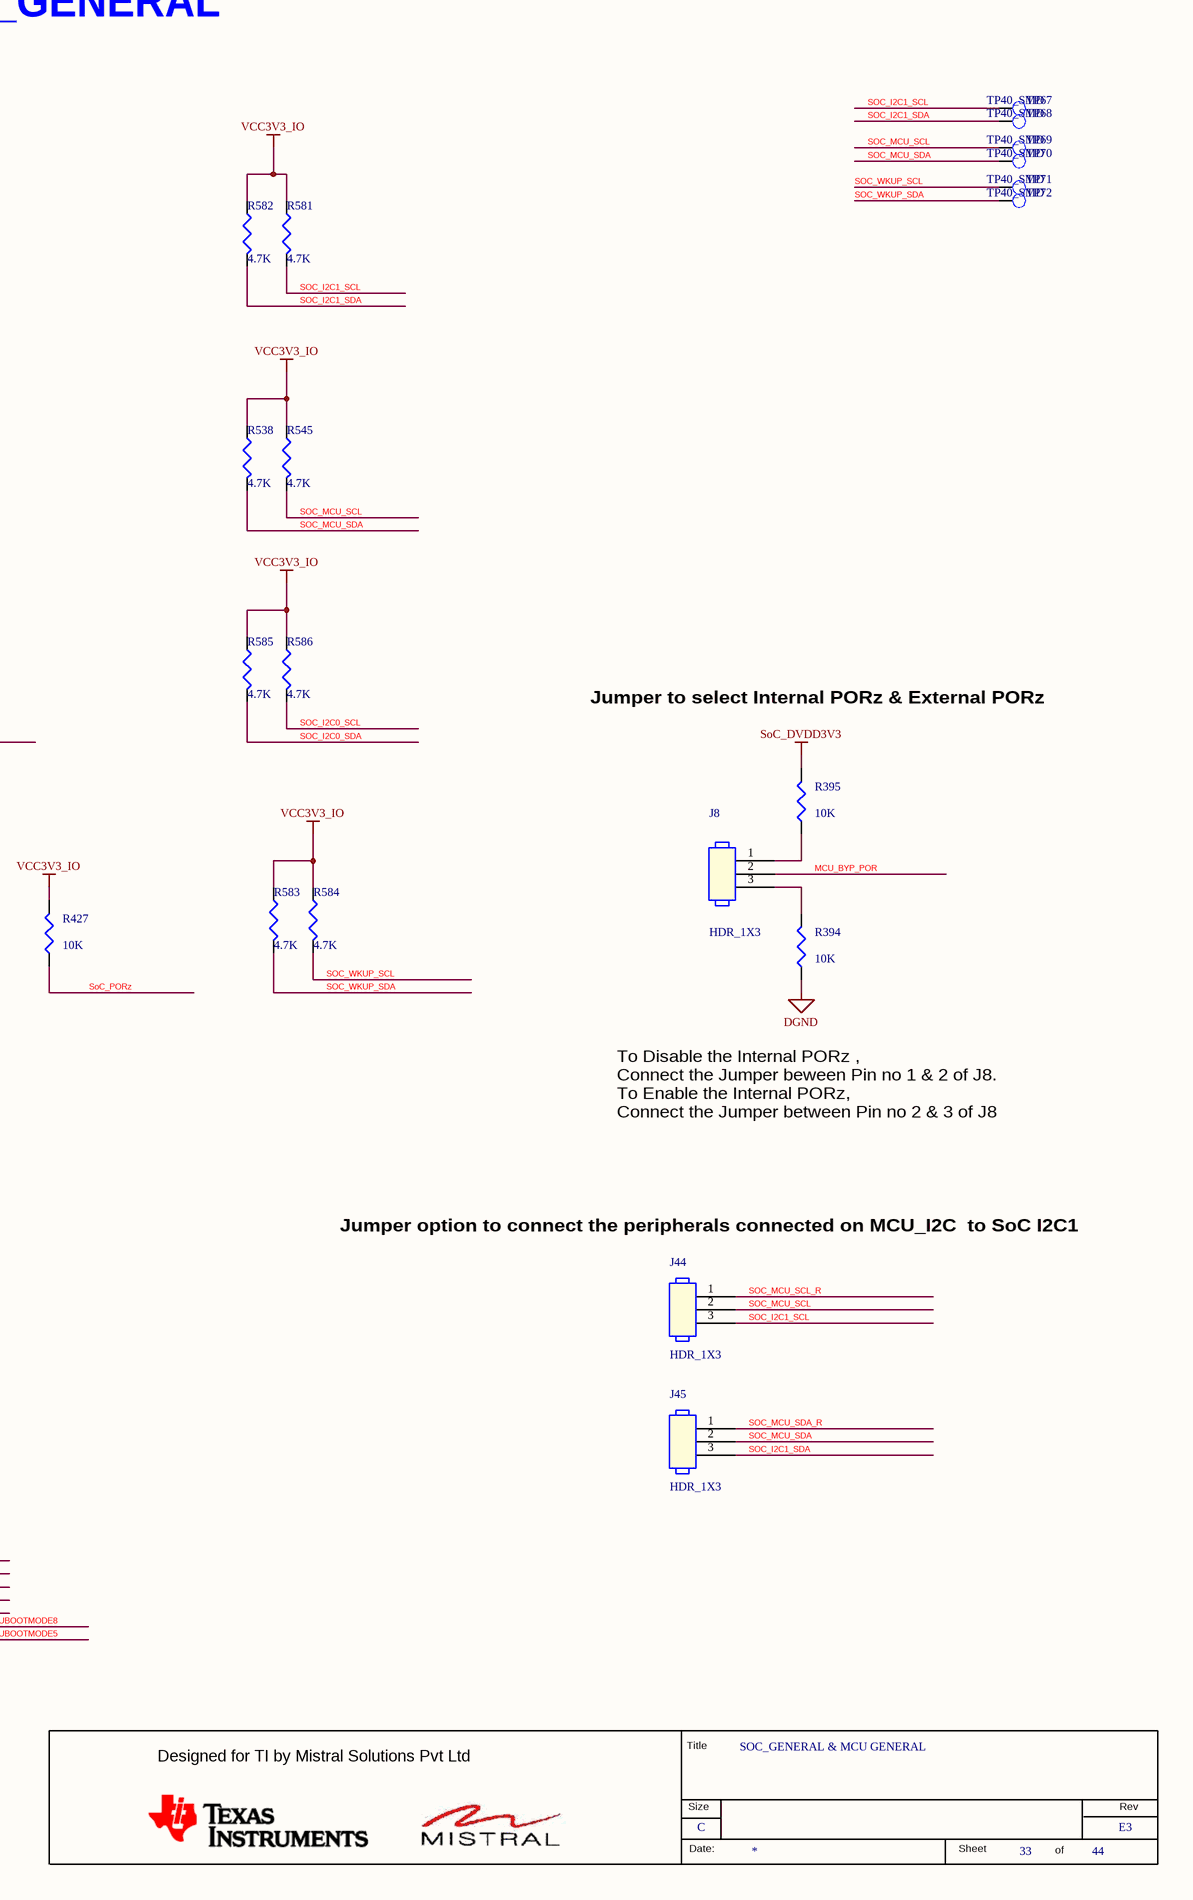
[diagram p61: 33-SOC_GENERAL AND MCU GENERAL.SchDoc, right]

### Parts
(Parts that share a designator on the sheet are numbered #1, #2 ... from top to bottom, then left to right.)
*#33  RevCode: E3  Title: SOC_GENERAL & MCU GENERAL  Page Size: C  Page Number: 33  Page Count: 44  (hidden comment: MISTRAL_TITLEBLK_CSIZE)  (graphical)
J8  HDR_1X3  [HDR_3X1_100_S_T]
J44  HDR_1X3  [HDR_3X1_100_S_T]
J45  HDR_1X3  [HDR_3X1_100_S_T]
R128  33E_1%  [RES0402_0-5]
R129  0E  [RES0402_0-5]
R131  33E_1%  [RES0402_0-5]
R132  22E_1%  [RES0402]
R208  22E_1%  [RES0402]
R394  10K  [RES0402_0-5]
R395  10K  [RES0402_0-5]
R427  10K  [RES0402_0-5]
R428  10K  [RES0402_0-5]
R432  22E_1%  [RES0402]
R489  22E_1%  [RES0402]
R491  22E_1%  [RES0402]
R538  4.7K  [RES0402]
R545  4.7K  [RES0402]
R581  4.7K  [RES0402]
R582  4.7K  [RES0402]
R583  4.7K  [RES0402]
R584  4.7K  [RES0402]
R585  4.7K  [RES0402]
R586  4.7K  [RES0402]
R729  0E  [RES0402_0-5]
TP29  TP40_SMD  [TP40_SMD]
TP38  TP40_SMD  [TP40_SMD]
TP40  TP40_SMD  [TP40_SMD]
TP43  TP40_SMD  [TP40_SMD]
TP47  TP40_SMD  [TP40_SMD]
TP48  TP40_SMD  [TP40_SMD]
TP49  TP40_SMD  [TP40_SMD]
TP50  TP40_SMD  [TP40_SMD]
TP52  TP40_SMD  [TP40_SMD]
TP53  TP40_SMD  [TP40_SMD]
TP57  THRU HOLE  [TP_40X65]
TP58  TP40_SMD  [TP40_SMD]
TP60  TP40_SMD  [TP40_SMD]
TP62  TP40_SMD  [TP40_SMD]
TP67  TP40_SMD  [TP40_SMD]
TP68  TP40_SMD  [TP40_SMD]
TP69  TP40_SMD  [TP40_SMD]
TP70  TP40_SMD  [TP40_SMD]
TP71  TP40_SMD  [TP40_SMD]
TP72  TP40_SMD  [TP40_SMD]
TP85  TP40_SMD  [TP40_SMD]
TP86  TP40_SMD  [TP40_SMD]
U34  MAXWELL M4  [BGA784_31-49_910X910_1-7]  (parts A,N of 19)

### Ports
ECAP0_IN_APWM0_OUT (out), GPIO_MCU_RGMII_RSTN (out), GPIO_SGMII_PHY_INT (in), MCU_BOOTMODE0, MCU_BOOTMODE1, MCU_BOOTMODE2, MCU_BOOTMODE3, MCU_BOOTMODE9, MCU_CLKOUT, MCU_MCAN0_RX (in), MCU_MCAN0_TX (in), MCU_MCAN1_RX (in), MCU_MCAN1_TX (in), MCU_MCAN1_TX/BOOTMODE4, MCU_MDC_RGMII_3V3 (in), MCU_MDIO_3V3 (in), MCU_PORz_OUT (in), MCU_SPI0_CLK (out), MCU_SPI0_CLK/BOOTMODE6, MCU_SPI0_CS0 (out), MCU_SPI0_D0/BOOTMODE7, OSC1_XI (in), OSC1_XOUT (in), PORz_OUT (in), PRG2_ETH1_LED_LINK/MCUBOOTMODE5, PRG2_ETH2_LED_LINK/MCUBOOTMODE8, PRG2_RGMII_INTn_3V3 (out), SoC_EMU0, SoC_EMU1, SOC_I2C0_SCL (in), SOC_I2C0_SDA, SOC_I2C1_SCL (in), SOC_I2C1_SDA, SOC_MAIN_UART0_CTS_3V3 (out), SOC_MAIN_UART0_RTS_3V3 (in), SOC_MAIN_UART0_RX_3V3 (out), SOC_MAIN_UART0_TX_3V3 (in), SOC_MCU_SCL (in), SOC_MCU_SDA, SoC_PORz (in), SOC_SPI0_CLK (in), SOC_SPI0_CS0 (in), SOC_SPI0_CS1 (in), SOC_SPI0_D0 (in), SOC_SPI0_D1 (out), SOC_SPI1_CLK (out), SOC_SPI1_CS0 (out), SOC_SPI1_CS1 (out), SOC_SPI1_MISO (in), SOC_SPI1_MOSI (out), SoC_TCK (in), SoC_TDI (in), SoC_TDO (out), SoC_TMS (in), SoC_TRST# (in), SoC_WARM_RESETZ (in), SOC_WKUP_SCL (out), SOC_WKUP_SDA, SOC_WKUP_UART0_CTS_3V3 (out), SOC_WKUP_UART0_RTS_3V3 (in), SOC_WKUP_UART0_RX_3V3 (in), SOC_WKUP_UART0_TX_3V3 (out), TIMER_IO0 (out), TIMER_IO1 (out), WKUP_LFOSC_RTC_XIN (in), WKUP_OSC0_XIN (in), WKUP_OSC0_XOUT (in)

### Nets
DGND: R394.1 R428.2
SoC_DVDD3V3: R395.2
VCC3V3_IO: R427.2 R538.1 R545.1 R581.1 R582.1 R583.1 R584.1 R585.1 R586.1
ATEST0_POK: TP29.1(TP) U34.B1(ATEST0_POK)
ATEST0_POR: TP50.1(TP) U34.AA6(ATEST0_POR)
ATEST-MAIN: TP58.1(TP) U34.AC23(ATEST_MAIN)
ECAP0_IN_APWM0_OUT: U34.D21(ECAP0_IN_APWM0_OUT) ; port ECAP0_IN_APWM0_OUT
GPIO_SGMII_PHY_INT: R729.2 ; port GPIO_SGMII_PHY_INT
IFORCE: TP62.1(TP) U34.B28(IFORCE)
MCU_BOOTMODE0: U34.AF4(WKUP_GPIO0_0) ; port MCU_BOOTMODE0
MCU_BOOTMODE1: U34.AF3(WKUP_GPIO0_1) ; port MCU_BOOTMODE1
MCU_BOOTMODE2: U34.AE3(WKUP_GPIO0_2) ; port MCU_BOOTMODE2
MCU_BOOTMODE3: U34.AD1(WKUP_GPIO0_3) ; port MCU_BOOTMODE3
MCU_BOOTMODE9: U34.AB4(WKUP_GPIO0_9) ; port MCU_BOOTMODE9
MCU_BYP_POR: J8.2 U34.V5(MCU_BYP_POR)
MCU_CLKOUT: R129.2 ; port MCU_CLKOUT
MCU_MCAN0_RX: U34.W2(MCU_MCAN0_RX) ; port MCU_MCAN0_RX
MCU_MCAN0_TX: R131.1 ; port MCU_MCAN0_TX
MCU_MCAN0_TX_R: R131.2 U34.W1(MCU_MCAN0_TX)
MCU_MCAN1_RX: U34.AD3(WKUP_GPIO0_5) ; port MCU_MCAN1_RX
MCU_MCAN1_TX: R128.2 ; port MCU_MCAN1_TX
MCU_MCAN1_TX/BOOTMODE4: R128.1 U34.AC3(WKUP_GPIO0_4) ; port MCU_MCAN1_TX/BOOTMODE4
MCU_MDC_RGMII: R132.2 U34.L1(MCU_MDIO_CLK)
MCU_MDC_RGMII_3V3: R132.1 ; port MCU_MDC_RGMII_3V3
MCU_MDIO_3V3: U34.L4(MCU_MDIO_DATA) ; port MCU_MDIO_3V3
MCU_PORz_OUT: TP85.1(TP) U34.V2(MCU_PORZ_OUT) ; port MCU_PORz_OUT
MCU_RESETSTATZ: TP38.1(TP) U34.V3(MCU_RESETSTATZ)
MCU_RESETZ: TP47.1(TP) U34.W4(MCU_RESETZ)
MCU_SAFETY_ERRORz: TP40.1(TP) U34.W3(MCU_SAFETY_ERRORN)
MCU_SPI0_CLK: R432.1 ; port MCU_SPI0_CLK
MCU_SPI0_CLK/BOOTMODE6: R432.2 U34.Y1(MCU_SPI0_CLK) ; port MCU_SPI0_CLK/BOOTMODE6
MCU_SPI0_CS0: U34.Y4(MCU_SPI0_CS0) ; port MCU_SPI0_CS0
MCU_SPI0_D0/BOOTMODE7: U34.Y3(MCU_SPI0_D0) ; port MCU_SPI0_D0/BOOTMODE7
MCU_SYSCLKOUT: TP43.1(TP) U34.AB3(WKUP_GPIO0_10)
MCU_TEST_POR: R428.1 U34.V4(MCU_TEST_POR)
OSC1_XI: U34.C22(OSC1_XI) ; port OSC1_XI
OSC1_XOUT: U34.E22(OSC1_XO) ; port OSC1_XOUT
PMIC_POWER-EN0: TP52.1(TP) U34.Y5(PMIC_POWER_EN0)
PMIC_POWER-EN1: TP49.1(TP) U34.AA5(PMIC_POWER_EN1)
PORz_OUT: TP86.1(TP) U34.C19(PORZ_OUT) ; port PORz_OUT
PRG2_ETH1_LED_LINK/MCUBOOTMODE5: U34.Y2(MCU_SPI0_D1) ; port PRG2_ETH1_LED_LINK/MCUBOOTMODE5
PRG2_ETH2_LED_LINK/MCUBOOTMODE8: U34.AC5(WKUP_GPIO0_8) ; port PRG2_ETH2_LED_LINK/MCUBOOTMODE8
PRG2_RGMII_INTn_3V3: U34.A22(EXT_REFCLK1) ; port PRG2_RGMII_INTn_3V3
RESETSTATZ: TP48.1(TP) U34.D19(RESETSTATZ)
SoC_EMU0: U34.AA2(EMU0) ; port SoC_EMU0
SoC_EMU1: U34.AA1(EMU1) ; port SoC_EMU1
SOC_I2C0_SCL: R586.2 U34.D20(I2C0_SCL) ; port SOC_I2C0_SCL
SOC_I2C0_SDA: R585.2 U34.C21(I2C0_SDA) ; port SOC_I2C0_SDA
SOC_I2C1_SCL: J44.3 R581.2 TP67.1(TP) U34.B21(I2C1_SCL) ; port SOC_I2C1_SCL
SOC_I2C1_SDA: J45.3 R582.2 TP68.1(TP) U34.E21(I2C1_SDA) ; port SOC_I2C1_SDA
SOC_MAIN_UART0_CTS_3V3: U34.AG11(UART0_CTSN) ; port SOC_MAIN_UART0_CTS_3V3
SOC_MAIN_UART0_RTS_3V3: U34.AD11(UART0_RTSN) ; port SOC_MAIN_UART0_RTS_3V3
SOC_MAIN_UART0_RX_3V3: U34.AF11(UART0_RXD) ; port SOC_MAIN_UART0_RX_3V3
SOC_MAIN_UART0_TX_3V3: U34.AE11(UART0_TXD) ; port SOC_MAIN_UART0_TX_3V3
SOC_MCU_SCL: J44.2 R545.2 TP69.1(TP) ; port SOC_MCU_SCL
SOC_MCU_SCL_R: J44.1 U34.AD8(MCU_I2C0_SCL)
SOC_MCU_SDA: J45.2 R538.2 TP70.1(TP) ; port SOC_MCU_SDA
SOC_MCU_SDA_R: J45.1 U34.AD7(MCU_I2C0_SDA)
SoC_PORz: R427.1 U34.E19(PORZ) U34.W5(MCU_PORZ) ; port SoC_PORz
SoC_SAFETY_ERRORz: TP57.1(TP) U34.E20(SOC_SAFETY_ERRORN)
SOC_SPI0_CLK: R491.1 ; port SOC_SPI0_CLK
SOC_SPI0_CLK_R: R491.2 U34.AH13(SPI0_CLK)
SOC_SPI0_CS0: U34.AG13(SPI0SCS0) ; port SOC_SPI0_CS0
SOC_SPI0_CS1: U34.AF13(SPI0SCS1) ; port SOC_SPI0_CS1
SOC_SPI0_D0: U34.AE13(SPI0_D0) ; port SOC_SPI0_D0
SOC_SPI0_D1: U34.AD13(SPI0_D1) ; port SOC_SPI0_D1
SOC_SPI1_CLK: R489.1 ; port SOC_SPI1_CLK
SOC_SPI1_CLK_R: R489.2 U34.AH12(SPI1_CLK)
SOC_SPI1_CS0: U34.AD12(SPI1_CS0) ; port SOC_SPI1_CS0
SOC_SPI1_CS1: U34.AG12(SPI1_CS1) ; port SOC_SPI1_CS1
SOC_SPI1_MISO: U34.AF12(SPI1_D1) ; port SOC_SPI1_MISO
SOC_SPI1_MOSI: U34.AE12(SPI1_D0) ; port SOC_SPI1_MOSI
SoC_TCK: U34.AA4(TCK) ; port SoC_TCK
SoC_TDI: U34.C20(TDI) ; port SoC_TDI
SoC_TDO: R208.2 ; port SoC_TDO
SoC_TMS: U34.A21(TMS) ; port SoC_TMS
SoC_TRST#: U34.AA3(TRSTN) ; port SoC_TRST#
SoC_WARM_RESETZ: U34.F17(RESETZ) ; port SoC_WARM_RESETZ
SOC_WKUP_SCL: R584.2 TP71.1(TP) U34.AC7(WKUP_I2C0_SCL) ; port SOC_WKUP_SCL
SOC_WKUP_SDA: R583.2 TP72.1(TP) U34.AD6(WKUP_I2C0_SDA) ; port SOC_WKUP_SDA
SOC_WKUP_UART0_CTS_3V3: U34.AC2(WKUP_GPIO0_6) ; port SOC_WKUP_UART0_CTS_3V3
SOC_WKUP_UART0_RTS_3V3: U34.AC1(WKUP_GPIO0_7) ; port SOC_WKUP_UART0_RTS_3V3
SOC_WKUP_UART0_RX_3V3: U34.AB1(WKUP_UART0_RXD) ; port SOC_WKUP_UART0_RX_3V3
SOC_WKUP_UART0_TX_3V3: U34.AB5(WKUP_UART0_TXD) ; port SOC_WKUP_UART0_TX_3V3
TEMP_DIODE_P: TP53.1(TP) U34.W6(TEMP_DIODE_P)
TIMER_IO0: U34.B22(TIMER_IO0) ; port TIMER_IO0
TIMER_IO1: U34.C23(TIMER_IO1) ; port TIMER_IO1
WKUP_LFOSC_RTC_XIN: U34.AE4(WKUP_LFOSC_XI) ; port WKUP_LFOSC_RTC_XIN
WKUP_OSC0_XIN: U34.AD5(WKUP_OSC0_XI) ; port WKUP_OSC0_XIN
WKUP_OSC0_XOUT: U34.AE6(WKUP_OSC0_XO) ; port WKUP_OSC0_XOUT
NetJ8_1: J8.1 R395.1
NetJ8_3: J8.3 R394.2
NetR129_1: R129.1 U34.AB2(WKUP_GPIO0_11)
NetR208_1: R208.1 U34.A20(TDO)
NetR729_1: R729.1 U34.F18(NMIN)
NetTP60_1: TP60.1(TP) U34.A27(VSENSE)

Not connected (* = marked no-connect by the designer): U34 AC4(WKUP_LFOSC_XO)*

### Notes on the sheet
- GENERAL & MCU_GENERAL
- Jumper to select Internal PORz & External PORz
- To Disable the Internal PORz ,
  Connect the Jumper beween Pin no 1 & 2 of J8.
  To Enable the Internal PORz,
  Connect the Jumper between Pin no 2 & 3 of J8
- Jumper option to connect the peripherals connected on MCU_I2C  to SoC I2C1
- MCU BOOTMODE
- (in symbol AM654X_BGA784, part A) GENERAL
- (in symbol MISTRAL_TITLEBLK_CSIZE) Title; Designed for TI by Mistral Solutions Pvt Ltd; Size; Rev; Date:; Sheet; of

### Library data of the parts
*#33 = MISTRAL_TITLEBLK_CSIZE: Issue: 1.0; Page Create Date: March  8, 1995; Page Modify Date: *
J8 J44 = HEADER_3X1: HDR 1X3 2.54MM PITCH ST TH; Part_type: CONNECTOR\HEADERS; Mfr_part_number: 68001-403HLF; Mfr_name: FCI; Mistral Part No: 150016060025-R; Custom_Duty: 15%; Customs_HS_Code: 85322990; Wattage: NA; Project: IKEYP; Chkd/date: VASANTHA/290616; Crtd /date: VASANTHA/290616; Datasheet: Y:\MIS_DATABASE\DATASHEETS\CONNECTORS\68000.PDF; Temperature: -40°C+105°C; Weight: NA; Height: 8.58MM; Distributor_part_number: 609-3471-ND; Distributor_name: DIGIKEY; Package: THRU-HOLE; Voltage: NA; Tolerance: NA; PCB Footprint: HDR_3X1_100_S_T; Library Ref: HEADER_3X1
J45 = HEADER_3X1: HDR 1X3 2.54MM PITCH ST TH; Mistral Part No: 150016060025-R; Mfr_name: FCI; Mfr_part_number: 68001-403HLF; Part_type: CONNECTOR\HEADERS; Project: IKEYP; Tolerance: NA; Customs_HS_Code: 85322990; Custom_Duty: 15%; Library Ref: HEADER_3X1; Voltage: NA; Wattage: NA; Package: THRU-HOLE; Distributor_name: DIGIKEY; Distributor_part_number: 609-3471-ND; Height: 8.58MM; Weight: NA; Temperature: -40°C+105°C; Datasheet: Y:\MIS_DATABASE\DATASHEETS\CONNECTORS\68000.PDF; Crtd /date: VASANTHA/290616; Chkd/date: VASANTHA/290616; PCB Footprint: HDR_3X1_100_S_T
R128 = RESISTOR_Dup5: RES 33E 1/16W 1% 0402; Part_type: RESISTORS\FIXED; Mfr_part_number: ERJ-2RKF33R0X; Mfr_name: PANASONIC-ECG; Mistral Part No: 110014110006-R; Custom_Duty: 15%; Customs_HS_Code: 85332119; Voltage: NA; Project: ZK BIOMETRIC; PCB Footprint: RES0402_0-5; MECHANICAL 3D STEP FILE: RES0402_0-5; Chkd/date: VASANTHA/061216; Crtd /date: JEBRAN/171114; Datasheet: Y:\MIS_DATABASE\DATASHEETS\RESISTORS\PAN-ERJSERIES.PDF; Temperature: -55°C+125°C; Weight: 0.8g/1000pcs; Height: 0.40MM; Distributor_part_number: P33.0LCT-ND; Distributor_name: DIGIKEY; Package: 0402; Wattage: 1/16W; Tolerance: 1%; Library Ref: RESISTOR
R129 = RESISTOR_Dup4: RES 0E 1/16W 0402; Mistral Part No: 110010080019-P; Mfr_name: VISHAY; Mfr_part_number: CRCW04020000Z0ED; Part_type: RESISTORS\FIXED; Project: PB_BUGBASE; Tolerance: NA; Customs_HS_Code: 85332119; Custom_Duty: 15%; NI_MARK: DNI; Voltage: NA; Wattage: 1/16W; Package: 0402; Distributor_name: DIGIKEY; Distributor_part_number: 541-0.0JCT-ND; Height: 0.40MM; Weight: 0.65g/1000pcs; Temperature: -55°C+155°C; Datasheet: Y:\MIS_DATABASE\DATASHEETS\RESISTORS\CRCW0603.PDF; Crtd /date: MUDDU/190810; Chkd/date: VASANTHA/201216; RoHS: Pb-Free; MECHANICAL 3D STEP FILE: RES0402_0-5; PCB Footprint: RES0402_0-5; Library Ref: RESISTOR; Footprint Ref: RES0402_0-5; Library Path: Y:\MIS_DATABASE\Library\ALTIUM_TOOL\SCHEMATICS_PARTS\MS_DISCRETE_Library.schlib; Footprint Path: Y:\MIS_DATABASE\Library\ALTIUM_TOOL\PCB_FOOTPRINTS\Altium_Footprint_Lib.PcbLib
R131 = RESISTOR_Dup5: RES 33E 1/16W 1% 0402; Mistral Part No: 110014110006-R; Mfr_name: PANASONIC-ECG; Mfr_part_number: ERJ-2RKF33R0X; Part_type: RESISTORS\FIXED; Project: ZK BIOMETRIC; Voltage: NA; Customs_HS_Code: 85332119; Custom_Duty: 15%; Tolerance: 1%; Wattage: 1/16W; Package: 0402; Distributor_name: DIGIKEY; Distributor_part_number: P33.0LCT-ND; Height: 0.40MM; Weight: 0.8g/1000pcs; Temperature: -55°C+125°C; Datasheet: Y:\MIS_DATABASE\DATASHEETS\RESISTORS\PAN-ERJSERIES.PDF; Crtd /date: JEBRAN/171114; Chkd/date: VASANTHA/061216; MECHANICAL 3D STEP FILE: RES0402_0-5; PCB Footprint: RES0402_0-5; Library Ref: RESISTOR
R132 = RESISTOR_Dup5: as R499 on sheet 32-APPLICATION BOARD CONNECTOR; PCB Footprint: RES0402; Tolerance: 1%; Wattage: 1/16W; Package: 0402; Distributor_name: DIGIKEY; Distributor_part_number: 311-22.0LRCT-ND; Distributor_name_A: DIGIKEY; Distributor_part_number_A: 541-22.0LCT-ND; Height: 0.40MM; Weight: 0.8g/1000pcs; Temperature: -55°C+155°C; Datasheet: Y:\MIS_DATABASE\DATASHEETS\RESISTORS\YAGEO-RC0402.PDF; Crtd /date: MAZHAR/090909; Chkd/date: SUHAS/290910; RoHS: Pb-Free; Library Ref: RESISTOR
R208 R489 R491 = RESISTOR_Dup4: RES 22E 1/16W 1% 0402; Cust_part_number: 4700-80047E; Alternate_mfr_part_number_A: CRCW040222R0FKED; Alternate_mfr_name_A: VISHAY; Part_type: RESISTORS\FIXED; Mfr_part_number: RC0402FR-0722RL; Mfr_name: YAGEO AMERICA; Mistral Part No: 110009090004-P; Remarks: In alternate datasheet it is RoHS COMPLIANT. Y:\MIS_DATABASE\DATASHEETS\RESISTORS\CRCW0402.PDF; Custom_Duty: 15%; Customs_HS_Code: 85332119; Voltage: 50V; Project: VMEFMCD; SIGNAL_MODEL: RESISTOR_RES0402_22E_22E; RoHS: Pb-Free; Chkd/date: SUHAS/290910; Crtd /date: MAZHAR/090909; Datasheet: Y:\MIS_DATABASE\DATASHEETS\RESISTORS\YAGEO-RC0402.PDF; Temperature: -55°C+155°C; Weight: 0.8g/1000pcs; Height: 0.40MM; Distributor_part_number_A: 541-22.0LCT-ND; Distributor_name_A: DIGIKEY; Distributor_part_number: 311-22.0LRCT-ND; Distributor_name: DIGIKEY; Package: 0402; Wattage: 1/16W; Tolerance: 1%; PCB Footprint: RES0402; Library Ref: RESISTOR
R394 R395 = RESISTOR_Dup5: RES 10K 1/16W 5% 0402; Part_type: RESISTORS\FIXED; Mfr_part_number: RC0402JR-0710KL; Mfr_name: YAGEO AMERICA; Mistral Part No: 110009030208-R; Custom_Duty: 15%; Customs_HS_Code: 85332119; Voltage: NA; Project: HSE; PCB Footprint: RES0402_0-5; MECHANICAL 3D STEP FILE: RES0402_0-5; RoHS: Pb-Free; Chkd/date: VASANTHA/061216; Crtd /date: MAZHAR/230805; Datasheet: Y:\MIS_DATABASE\DATASHEETS\RESISTORS\YAGEO-RC0402.PDF; Temperature: -55°C+155°C; Weight: 0.65mg; Height: 0.40MM; Distributor_part_number: 311-10KJRCT-ND; Distributor_name: DIGIKEY; Package: 0402; Wattage: 1/16W; Tolerance: 5%; Library Ref: RESISTOR; Footprint Ref: RES0402_0-5; Library Path: Y:\MIS_DATABASE\Library\ALTIUM_TOOL\SCHEMATICS_PARTS\MS_DISCRETE_Library.schlib; Footprint Path: Y:\MIS_DATABASE\Library\ALTIUM_TOOL\PCB_FOOTPRINTS\Altium_Footprint_Lib.PcbLib
R427 = RESISTOR_Dup5: RES 10K 1/16W 5% 0402; Mistral Part No: 110009030208-R; Mfr_name: YAGEO AMERICA; Mfr_part_number: RC0402JR-0710KL; Part_type: RESISTORS\FIXED; Project: HSE; Voltage: NA; Customs_HS_Code: 85332119; Custom_Duty: 15%; NI_MARK: DNI; Tolerance: 5%; Wattage: 1/16W; Package: 0402; Distributor_name: DIGIKEY; Distributor_part_number: 311-10KJRCT-ND; Height: 0.40MM; Weight: 0.65mg; Temperature: -55°C+155°C; Datasheet: Y:\MIS_DATABASE\DATASHEETS\RESISTORS\YAGEO-RC0402.PDF; Crtd /date: MAZHAR/230805; Chkd/date: VASANTHA/061216; RoHS: Pb-Free; MECHANICAL 3D STEP FILE: RES0402_0-5; PCB Footprint: RES0402_0-5; Library Ref: RESISTOR; Footprint Ref: RES0402_0-5; Library Path: Y:\MIS_DATABASE\Library\ALTIUM_TOOL\SCHEMATICS_PARTS\MS_DISCRETE_Library.schlib; Footprint Path: Y:\MIS_DATABASE\Library\ALTIUM_TOOL\PCB_FOOTPRINTS\Altium_Footprint_Lib.PcbLib
R428 = RESISTOR_Dup5: as R307 on sheet 32-APPLICATION BOARD CONNECTOR; PCB Footprint: RES0402_0-5; Tolerance: 5%; Wattage: 1/16W; Package: 0402; Distributor_name: DIGIKEY; Distributor_part_number: 311-10KJRCT-ND; Height: 0.40MM; Weight: 0.65mg; Temperature: -55°C+155°C; Datasheet: Y:\MIS_DATABASE\DATASHEETS\RESISTORS\YAGEO-RC0402.PDF; Crtd /date: MAZHAR/230805; Chkd/date: VASANTHA/061216; RoHS: Pb-Free; MECHANICAL 3D STEP FILE: RES0402_0-5; Library Ref: RESISTOR; Footprint Ref: RES0402_0-5; Library Path: Y:\MIS_DATABASE\Library\ALTIUM_TOOL\SCHEMATICS_PARTS\MS_DISCRETE_Library.schlib; Footprint Path: Y:\MIS_DATABASE\Library\ALTIUM_TOOL\PCB_FOOTPRINTS\Altium_Footprint_Lib.PcbLib
R432 = RESISTOR_Dup4: RES 22E 1/16W 1% 0402; Mistral Part No: 110009090004-P; Mfr_name: YAGEO AMERICA; Mfr_part_number: RC0402FR-0722RL; Part_type: RESISTORS\FIXED; Alternate_mfr_name_A: VISHAY; Alternate_mfr_part_number_A: CRCW040222R0FKED; Cust_part_number: 4700-80047E; SIGNAL_MODEL: RESISTOR_RES0402_22E_22E; Project: VMEFMCD; Voltage: 50V; Customs_HS_Code: 85332119; Custom_Duty: 15%; Remarks: In alternate datasheet it is RoHS COMPLIANT. Y:\MIS_DATABASE\DATASHEETS\RESISTORS\CRCW0402.PDF; Library Ref: RESISTOR; Tolerance: 1%; Wattage: 1/16W; Package: 0402; Distributor_name: DIGIKEY; Distributor_part_number: 311-22.0LRCT-ND; Distributor_name_A: DIGIKEY; Distributor_part_number_A: 541-22.0LCT-ND; Height: 0.40MM; Weight: 0.8g/1000pcs; Temperature: -55°C+155°C; Datasheet: Y:\MIS_DATABASE\DATASHEETS\RESISTORS\YAGEO-RC0402.PDF; Crtd /date: MAZHAR/090909; Chkd/date: SUHAS/290910; RoHS: Pb-Free; PCB Footprint: RES0402
R538 R582 R584 R585 = RESISTOR_Dup5: RES 4.7K 1/16W 5% 0402; Part_type: RESISTORS\FIXED; Mfr_part_number: RC0402JR-074K7L; Mfr_name: YAGEO AMERICA; Mistral Part No: 110009030792-R; Custom_Duty: 15%; Customs_HS_Code: 85332119; Voltage: NA; Project: TMDXCSK368; Chkd/date: VASANTHA/130516; Crtd /date: VASANTHA/130516; Datasheet: Y:\MIS_DATABASE\DATASHEETS\RESISTORS\YAGEO-RC0402.PDF; Temperature: -55°C+155°C; Weight: NA; Height: 0.55MM; Distributor_part_number: 311-4.7KJRCT-ND; Distributor_name: DIGIKEY; Package: 0402; Wattage: 1/16W; Tolerance: 5%; PCB Footprint: RES0402; Library Ref: RESISTOR
R545 R581 R583 R586 = RESISTOR_Dup5: RES 4.7K 1/16W 5% 0402; Mistral Part No: 110009030792-R; Mfr_name: YAGEO AMERICA; Mfr_part_number: RC0402JR-074K7L; Part_type: RESISTORS\FIXED; Project: TMDXCSK368; Voltage: NA; Customs_HS_Code: 85332119; Custom_Duty: 15%; Tolerance: 5%; Wattage: 1/16W; Package: 0402; Distributor_name: DIGIKEY; Distributor_part_number: 311-4.7KJRCT-ND; Height: 0.55MM; Weight: NA; Temperature: -55°C+155°C; Datasheet: Y:\MIS_DATABASE\DATASHEETS\RESISTORS\YAGEO-RC0402.PDF; Crtd /date: VASANTHA/130516; Chkd/date: VASANTHA/130516; PCB Footprint: RES0402; Library Ref: RESISTOR
R729 = RESISTOR_Dup5: as R574 on sheet 32-APPLICATION BOARD CONNECTOR; PCB Footprint: RES0402_0-5; MECHANICAL 3D STEP FILE: RES0402_0-5; RoHS: Pb-Free; Chkd/date: VASANTHA/201216; Crtd /date: MUDDU/190810; Datasheet: Y:\MIS_DATABASE\DATASHEETS\RESISTORS\CRCW0603.PDF; Temperature: -55°C+155°C; Weight: 0.65g/1000pcs; Height: 0.40MM; Distributor_part_number: 541-0.0JCT-ND; Distributor_name: DIGIKEY; Package: 0402; Wattage: 1/16W; Tolerance: NA; Library Ref: RESISTOR; Footprint Ref: RES0402_0-5; Library Path: Y:\MIS_DATABASE\Library\ALTIUM_TOOL\SCHEMATICS_PARTS\MS_DISCRETE_Library.schlib; Footprint Path: Y:\MIS_DATABASE\Library\ALTIUM_TOOL\PCB_FOOTPRINTS\Altium_Footprint_Lib.PcbLib
TP29 TP38 TP40 TP47 TP48 TP52 TP67 TP70 TP71 TP85 = TESTPOINT: TESTPOINT CIR 40 SMD; Mistral Part No: 130009030933; Mfr_name: LOCAL; Project: RAINIER-3; Tolerance: NA; NI_MARK: DNI; Mfr_part_number: TP40_SMD; Part_type: TESTPOINT; Package: SMD; Distributor_name: NA; Distributor_part_number: NA; Height: NA; Crtd /date: MAZHAR/190505; Chkd/date: MAZHAR/190505; Voltage: NA; Wattage: NA; Weight: NA; Temperature: NA; Datasheet: NA; MECHANICAL 3D STEP FILE: NA; Library Path: Y:\MIS_DATABASE\Library\ALTIUM_TOOL\SCHEMATICS_PARTS\MS_DISCRETE_Library.schlib; Footprint Path: Y:\MIS_DATABASE\Library\ALTIUM_TOOL\PCB_FOOTPRINTS\Altium_Footprint_Lib.PcbLib; PCB Footprint: TP40_SMD; Library Ref: TESTPOINT; Footprint Ref: TP40_SMD; RoHS: NA
TP43 = TESTPOINT: as TP32 on sheet 32-APPLICATION BOARD CONNECTOR; Chkd/date: MAZHAR/190505; Crtd /date: MAZHAR/190505; Height: NA; Distributor_part_number: NA; Distributor_name: NA; Package: SMD; Part_type: TESTPOINT; Mfr_part_number: TP40_SMD; Voltage: NA; Wattage: NA; Weight: NA; Temperature: NA; Datasheet: NA; MECHANICAL 3D STEP FILE: NA; Library Path: Y:\MIS_DATABASE\Library\ALTIUM_TOOL\SCHEMATICS_PARTS\MS_DISCRETE_Library.schlib; Footprint Path: Y:\MIS_DATABASE\Library\ALTIUM_TOOL\PCB_FOOTPRINTS\Altium_Footprint_Lib.PcbLib; PCB Footprint: TP40_SMD; Library Ref: TESTPOINT; Footprint Ref: TP40_SMD; RoHS: NA
TP49 TP50 TP53 TP62 TP68 TP69 TP72 TP86 = TESTPOINT: TESTPOINT CIR 40 SMD; Mfr_name: LOCAL; Mistral Part No: 130009030933; MECHANICAL 3D STEP FILE: NA; Project: RAINIER-3; NI_MARK: DNI; PCB Footprint: TP40_SMD; Footprint Path: Y:\MIS_DATABASE\Library\ALTIUM_TOOL\PCB_FOOTPRINTS\Altium_Footprint_Lib.PcbLib; Library Path: Y:\MIS_DATABASE\Library\ALTIUM_TOOL\SCHEMATICS_PARTS\MS_DISCRETE_Library.schlib; Datasheet: NA; Temperature: NA; Weight: NA; Wattage: NA; Voltage: NA; Tolerance: NA; Chkd/date: MAZHAR/190505; Crtd /date: MAZHAR/190505; Height: NA; Distributor_part_number: NA; Distributor_name: NA; Package: SMD; Part_type: TESTPOINT; Mfr_part_number: TP40_SMD; Library Ref: TESTPOINT; Footprint Ref: TP40_SMD; RoHS: NA
TP57 = TESTPOINT: TESTPOINT 1.0MM DRILL PTH; Part_type: MISC\TESTPOINT; Mfr_name: LOCAL; Mistral Part No: 130009030938; Project: HSE; NI_MARK: DNI; PCB Footprint: TP_40X65; Chkd/date: MAZHAR/271211; Crtd /date: SHREESHAIL/041005; Datasheet: NA; Height: NA; Distributor_part_number: NA; Distributor_name: NA; Package: THRU-HOLE; Mfr_part_number: TP_40X65; Library Ref: TESTPOINT
TP58 TP60 = TESTPOINT: as TP30 on sheet 32-APPLICATION BOARD CONNECTOR; PCB Footprint: TP40_SMD; Footprint Path: Y:\MIS_DATABASE\Library\ALTIUM_TOOL\PCB_FOOTPRINTS\Altium_Footprint_Lib.PcbLib; Library Path: Y:\MIS_DATABASE\Library\ALTIUM_TOOL\SCHEMATICS_PARTS\MS_DISCRETE_Library.schlib; Datasheet: NA; Temperature: NA; Weight: NA; Wattage: NA; Voltage: NA; Tolerance: NA; Mfr_part_number: TP40_SMD; Part_type: TESTPOINT; Package: SMD; Distributor_name: NA; Distributor_part_number: NA; Height: NA; Crtd /date: MAZHAR/190505; Chkd/date: MAZHAR/190505; Library Ref: TESTPOINT; Footprint Ref: TP40_SMD; RoHS: NA
U34 = AM654X_BGA784: as U34 on sheet 32-APPLICATION BOARD CONNECTOR; PCB Footprint: BGA784_31-49_910X910_1-7; Voltage: NA; Wattage: NA; Package: BGA784; Distributor_name: NA; Distributor_part_number: NA; Height: 1.63MM; Weight: NA; Temperature: NA; Datasheet: Y:\MIS_DATABASE\DATASHEETS\ICS\DIGITAL\MICROCONTROLLER\MAXWELLM4.PDF; Crtd /date: MANIRAJA/130717; Chkd/date: MANIRAJA/130717; MECHANICAL 3D STEP FILE: BGA784_31-49_910X910_1-7; Library Ref: AM654X_BGA784